# Altium project XCKU5P.PrjPCB
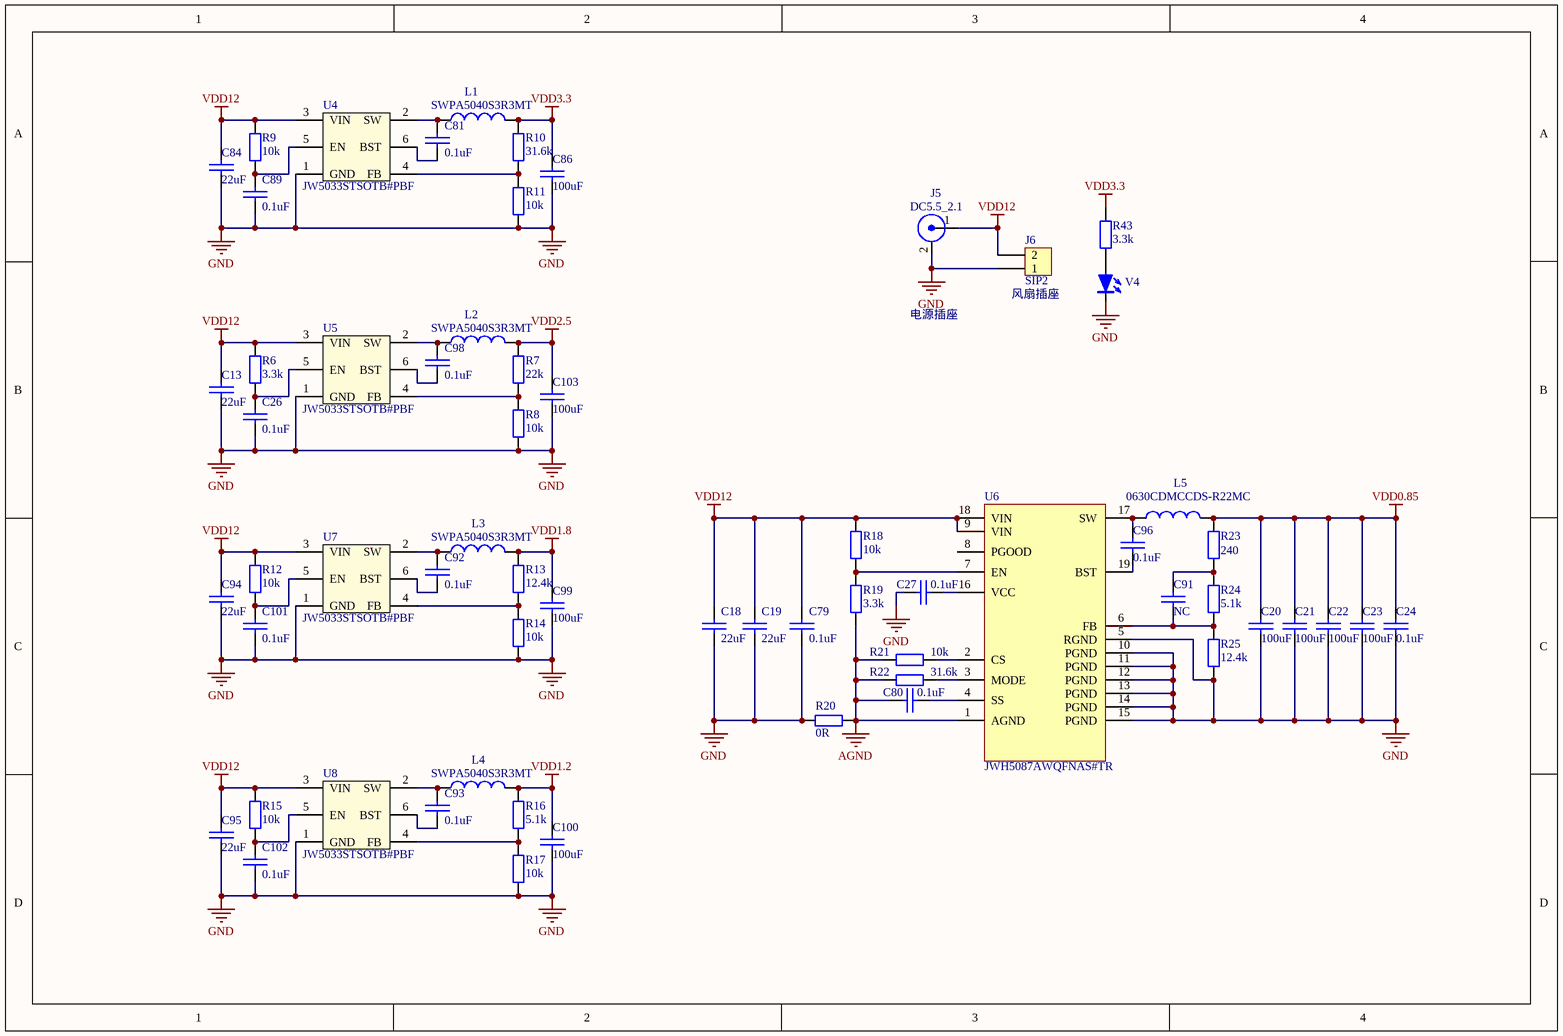
[diagram p0: POWER.SchDoc]
6 sheets, 206 parts. Net scope: global (net labels, ports and power ports of the same name join across sheets).
Board file: XCKU5P.PcbDoc
Sheets:
  POWER.SchDoc
  FPGA POWER.SchDoc
  FPGA HD BANK.SchDoc
  FPGA HP BANK.SchDoc
  FPGA SYSTERM.SchDoc
  DDR4.SchDoc

## Sheet POWER.SchDoc
size A4

### Parts
C13  22uF  [1210_C_M]
C18  22uF  [1210_C_M]
C19  22uF  [1210_C_M]
C20  100uF  [1210_C_M]
C21  100uF  [1210_C_M]
C22  100uF  [1210_C_M]
C23  100uF  [1210_C_M]
C24  0.1uF  [0402_C_M]
C26  0.1uF  [0402_C_M]
C27  0.1uF  [0402_C_M]
C79  0.1uF  [0402_C_M]
C80  0.1uF  [0402_C_M]
C81  0.1uF  [0402_C_M]
C84  22uF  [1210_C_M]
C86  100uF  [1210_C_M]
C89  0.1uF  [0402_C_M]
C91  NC  [0402_C_M]
C92  0.1uF  [0402_C_M]
C93  0.1uF  [0402_C_M]
C94  22uF  [1210_C_M]
C95  22uF  [1210_C_M]
C96  0.1uF  [0402_C_M]
C98  0.1uF  [0402_C_M]
C99  100uF  [1210_C_M]
C100  100uF  [1210_C_M]
C101  0.1uF  [0402_C_M]
C102  0.1uF  [0402_C_M]
C103  100uF  [1210_C_M]
J5  DC5.5_2.1  [DC5.5]
J6  SIP2  [2.54mm_2p]
L1  SWPA5040S3R3MT  [CD42]
L2  SWPA5040S3R3MT  [CD42]
L3  SWPA5040S3R3MT  [CD42]
L4  SWPA5040S3R3MT  [CD42]
L5  0630CDMCCDS-R22MC  [SWPA8050S]
R6  3.3k  [0402_R_M]
R7  22k  [0402_R_M]
R8  10k  [0402_R_M]
R9  10k  [0402_R_M]
R10  31.6k  [0402_R_M]
R11  10k  [0402_R_M]
R12  10k  [0402_R_M]
R13  12.4k  [0402_R_M]
R14  10k  [0402_R_M]
R15  10k  [0402_R_M]
R16  5.1k  [0402_R_M]
R17  10k  [0402_R_M]
R18  10k  [0402_R_M]
R19  3.3k  [0402_R_M]
R20  0R  [0402_R_M]
R21  10k  [0402_R_M]
R22  31.6k  [0402_R_M]
R23  240  [0402_R_M]
R24  5.1k  [0402_R_M]
R25  12.4k  [0402_R_M]
R43  3.3k  [0402_R_M]
U4  JW5033STSOTB#PBF  [SOT23-6]
U5  JW5033STSOTB#PBF  [SOT23-6]
U6  JWH5087AWQFNAS#TR
U7  JW5033STSOTB#PBF  [SOT23-6]
U8  JW5033STSOTB#PBF  [SOT23-6]
V4  LED  [0805D]  (value not drawn)

### Nets
AGND: C80.1 R19.1 R20.2 R21.2 R22.2 U6.1(AGND)
GND: C13.2 C18.1 C19.1 C20.2 C21.2 C22.2 C23.2 C24.1 C26.2 C27.2 C79.2 C84.2 C86.2 C89.2 C94.2 C95.2 C99.2 C100.2 C101.2 C102.2 C103.2 J5.2 J6.1 R8.2 R11.2 R14.2 R17.2 R20.1 R25.2 U4.1(GND) U5.1(GND) U6.5(RGND) U6.10(PGND) U6.11(PGND) U6.12(PGND) U6.13(PGND) U6.14(PGND) U6.15(PGND) U7.1(GND) U8.1(GND) V4.2
VDD0.85: C20.1 C21.1 C22.1 C23.1 C24.2 L5.2 R23.1
VDD1.2: C100.1 L4.2 R16.2
VDD1.8: C99.1 L3.2 R13.2
VDD2.5: C103.1 L2.2 R7.2
VDD3.3: C86.1 L1.2 R10.2 R43.2
VDD12: C13.1 C18.2 C19.2 C79.1 C84.1 C94.1 C95.1 J5.1 J6.2 R6.2 R9.2 R12.2 R15.2 R18.1 U4.3(VIN) U5.3(VIN) U6.9(VIN) U6.18(VIN) U7.3(VIN) U8.3(VIN)
NetC26_1: C26.1 R6.1 U5.5(EN)
NetC27_1: C27.1 U6.16(VCC)
NetC80_2: C80.2 U6.4(SS)
NetC81_1: C81.1 U4.6(BST)
NetC81_2: C81.2 L1.1 U4.2(SW)
NetC89_1: C89.1 R9.1 U4.5(EN)
NetC91_1: C91.1 R24.2 R25.1 U6.6(FB)
NetC91_2: C91.2 R23.2 R24.1
NetC92_1: C92.1 U7.6(BST)
NetC92_2: C92.2 L3.1 U7.2(SW)
NetC93_1: C93.1 U8.6(BST)
NetC93_2: C93.2 L4.1 U8.2(SW)
NetC96_1: C96.1 U6.19(BST)
NetC96_2: C96.2 L5.1 U6.17(SW)
NetC98_1: C98.1 U5.6(BST)
NetC98_2: C98.2 L2.1 U5.2(SW)
NetC101_1: C101.1 R12.1 U7.5(EN)
NetC102_1: C102.1 R15.1 U8.5(EN)
NetR7_1: R7.1 R8.1 U5.4(FB)
NetR10_1: R10.1 R11.1 U4.4(FB)
NetR13_1: R13.1 R14.1 U7.4(FB)
NetR16_1: R16.1 R17.1 U8.4(FB)
NetR18_2: R18.2 R19.2 U6.7(EN)
NetR21_1: R21.1 U6.2(CS)
NetR22_1: R22.1 U6.3(MODE)
NetR43_1: R43.1 V4.1

Not connected (* = marked no-connect by the designer): U6 8(PGOOD)

### Notes on the sheet
- (near J6) 风扇插座
- 电源插座

### Library data of the parts
C13 C18-C24 C26 C27 C79-C81 C84 C86 C89 C91-C96 C98-C103 = CAP
J5 = BNC
L1-L5 = INDUCTOR1
R6-R25 R43 = RES2
U4 U5 U7 U8 = JW5060TTSOTB#PBF
U6 = IC_JW85012
V4 = LED2

## Sheet FPGA POWER.SchDoc
size A3
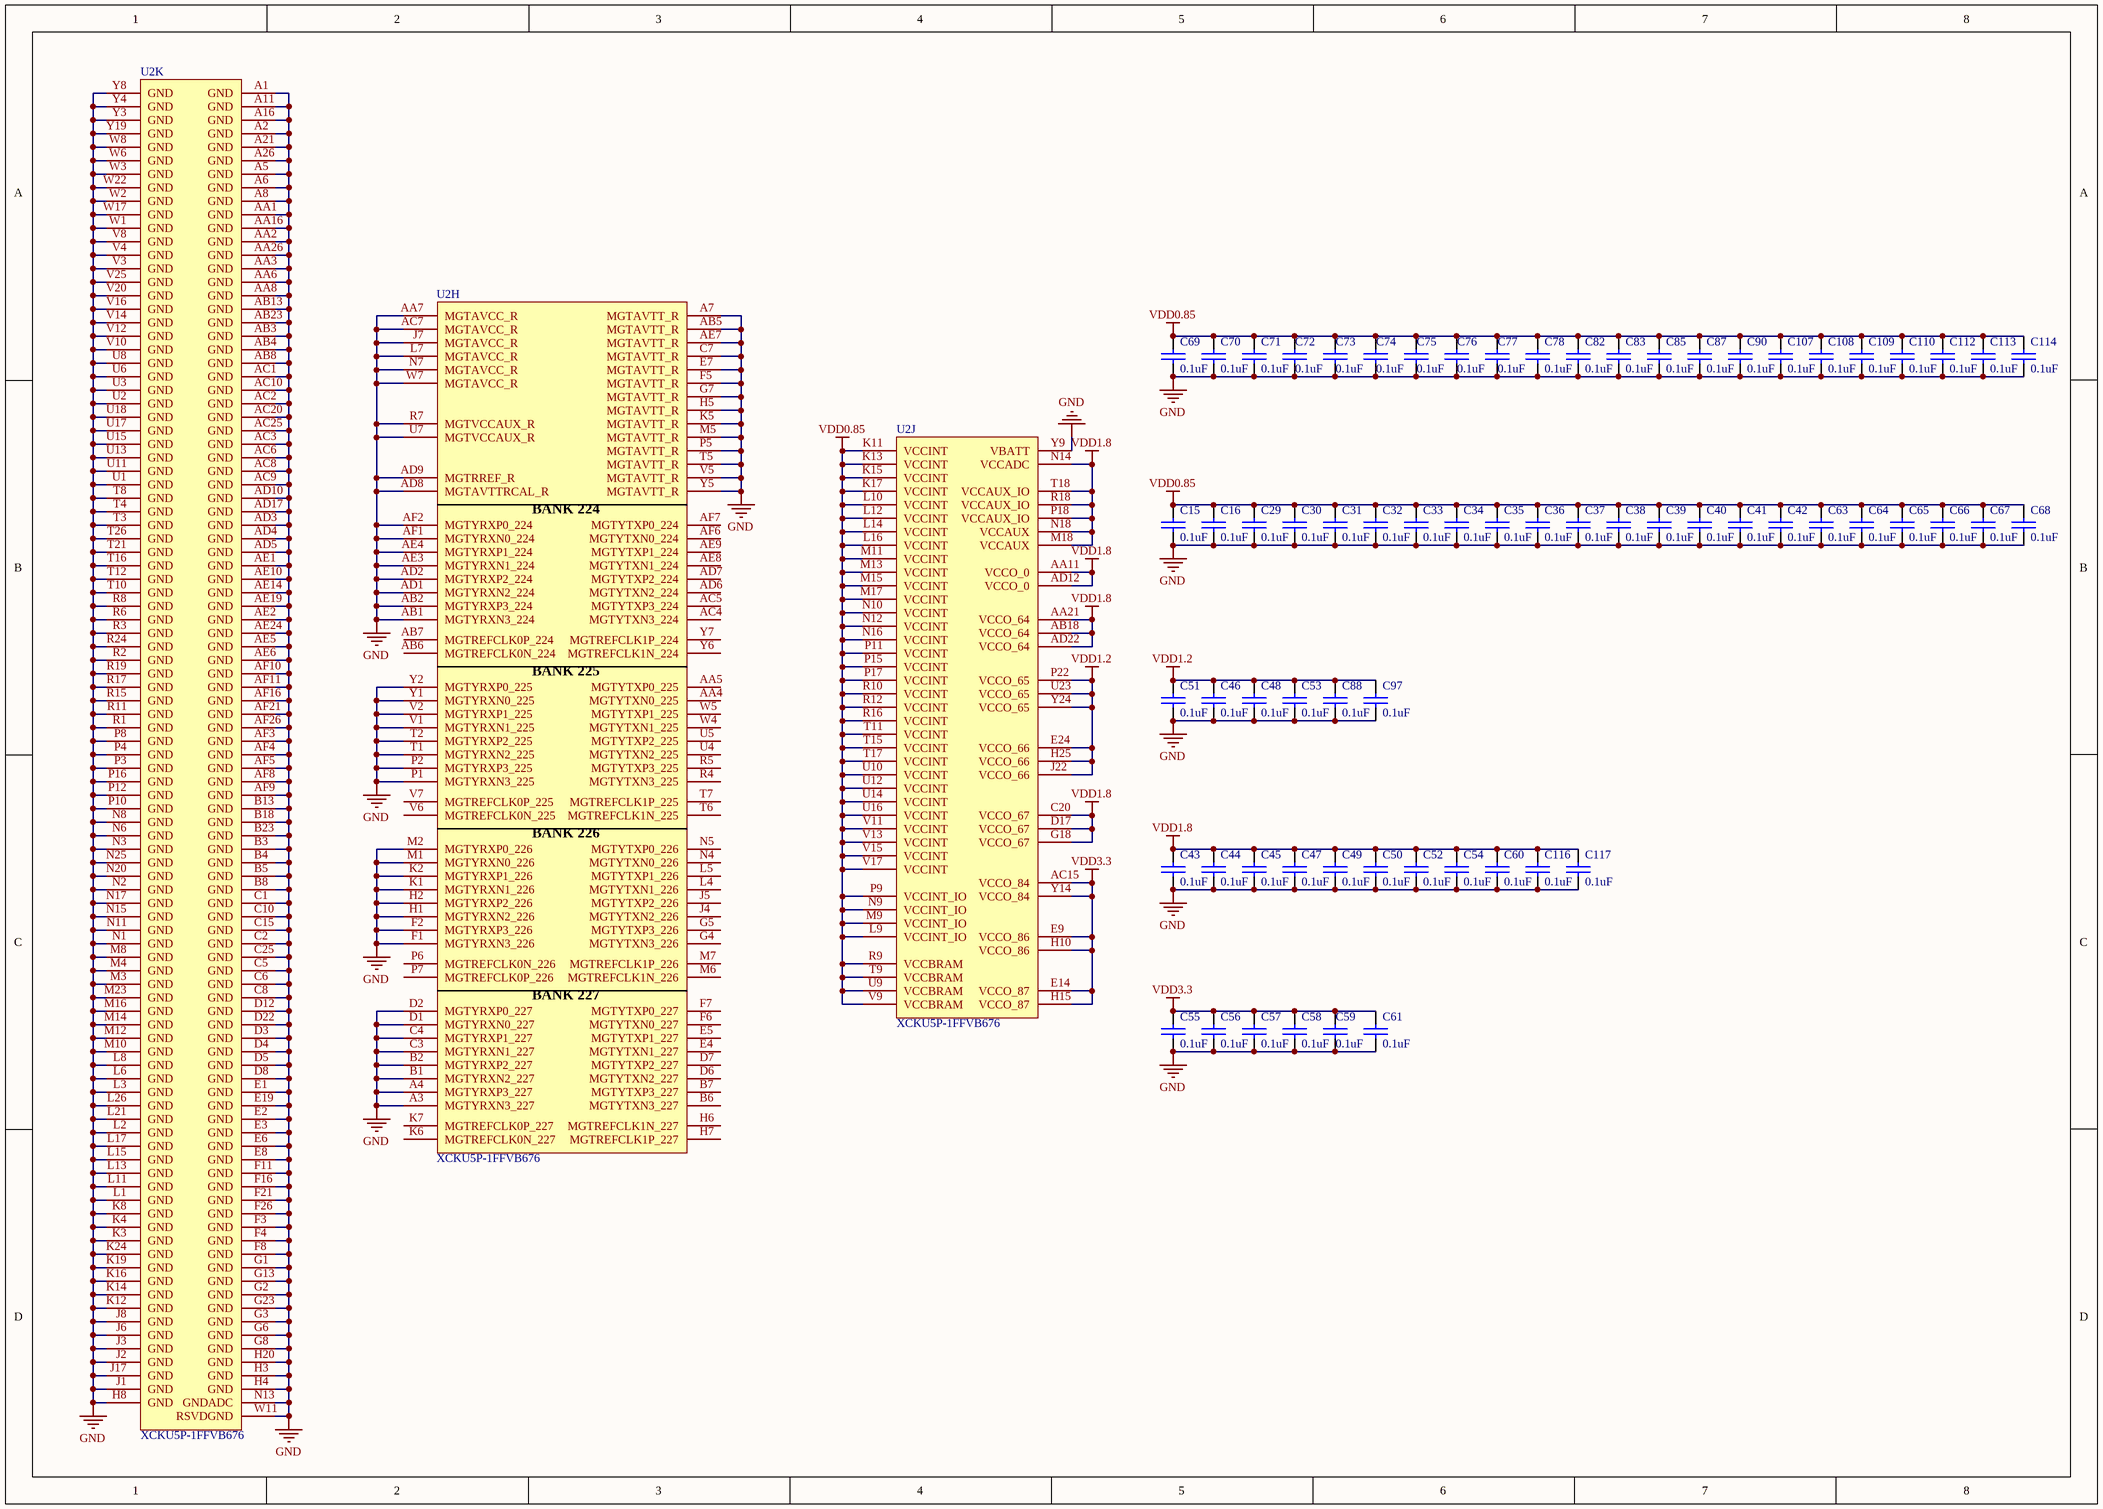
[diagram p1: FPGA POWER.SchDoc]

### Parts
C15  0.1uF  [0402_C_M]
C16  0.1uF  [0402_C_M]
C29  0.1uF  [0402_C_M]
C30  0.1uF  [0402_C_M]
C31  0.1uF  [0402_C_M]
C32  0.1uF  [0402_C_M]
C33  0.1uF  [0402_C_M]
C34  0.1uF  [0402_C_M]
C35  0.1uF  [0402_C_M]
C36  0.1uF  [0402_C_M]
C37  0.1uF  [0402_C_M]
C38  0.1uF  [0402_C_M]
C39  0.1uF  [0402_C_M]
C40  0.1uF  [0402_C_M]
C41  0.1uF  [0402_C_M]
C42  0.1uF  [0402_C_M]
C43  0.1uF  [0402_C_M]
C44  0.1uF  [0402_C_M]
C45  0.1uF  [0402_C_M]
C46  0.1uF  [0402_C_M]
C47  0.1uF  [0402_C_M]
C48  0.1uF  [0402_C_M]
C49  0.1uF  [0402_C_M]
C50  0.1uF  [0402_C_M]
C51  0.1uF  [0402_C_M]
C52  0.1uF  [0402_C_M]
C53  0.1uF  [0402_C_M]
C54  0.1uF  [0402_c_m]
C55  0.1uF  [0402_C_M]
C56  0.1uF  [0402_C_M]
C57  0.1uF  [0402_C_M]
C58  0.1uF  [0402_C_M]
C59  0.1uF  [0402_C_M]
C60  0.1uF  [0402_C_M]
C61  0.1uF  [0402_C_M]
C63  0.1uF  [0402_C_M]
C64  0.1uF  [0402_C_M]
C65  0.1uF  [0402_C_M]
C66  0.1uF  [0402_C_M]
C67  0.1uF  [0402_C_M]
C68  0.1uF  [0402_C_M]
C69  0.1uF  [0402_C_M]
C70  0.1uF  [0402_C_M]
C71  0.1uF  [0402_C_M]
C72  0.1uF  [0402_C_M]
C73  0.1uF  [0402_C_M]
C74  0.1uF  [0402_C_M]
C75  0.1uF  [0402_C_M]
C76  0.1uF  [0402_C_M]
C77  0.1uF  [0402_C_M]
C78  0.1uF  [0402_C_M]
C82  0.1uF  [0402_C_M]
C83  0.1uF  [0402_C_M]
C85  0.1uF  [0402_C_M]
C87  0.1uF  [0402_C_M]
C88  0.1uF  [0402_C_M]
C90  0.1uF  [0402_C_M]
C97  0.1uF  [0402_C_M]
C107  0.1uF  [0402_C_M]
C108  0.1uF  [0402_C_M]
C109  0.1uF  [0402_C_M]
C110  0.1uF  [0402_C_M]
C112  0.1uF  [0402_C_M]
C113  0.1uF  [0402_C_M]
C114  0.1uF  [0402_C_M]
C116  0.1uF  [0402_C_M]
C117  0.1uF  [0402_C_M]
U2  XCKU5P-1FFVB676  (parts H,J,K of 11)

### Nets
GND: C15.2 C16.2 C29.2 C30.2 C31.2 C32.2 C33.2 C34.2 C35.2 C36.2 C37.2 C38.2 C39.2 C40.2 C41.2 C42.2 C43.2 C44.2 C45.2 C46.2 C47.2 C48.2 C49.2 C50.2 C51.2 C52.2 C53.2 C54.2 C55.2 C56.2 C57.2 C58.2 C59.2 C60.2 C61.2 C63.2 C64.2 C65.2 C66.2 C67.2 C68.2 C69.2 C70.2 C71.2 C72.2 C73.2 C74.2 C75.2 C76.2 C77.2 C78.2 C82.2 C83.2 C85.2 C87.2 C88.2 C90.2 C97.2 C107.2 C108.2 C109.2 C110.2 C112.2 C113.2 C114.2 C116.2 C117.2 U2.A1(GND) U2.A2(GND) U2.A3(MGTYRXN3_227) U2.A4(MGTYRXP3_227) U2.A5(GND) U2.A6(GND) U2.A7(MGTAVTT_R) U2.A8(GND) U2.A11(GND) U2.A16(GND) U2.A21(GND) U2.A26(GND) U2.AA1(GND) U2.AA2(GND) U2.AA3(GND) U2.AA6(GND) U2.AA7(MGTAVCC_R) U2.AA8(GND) U2.AA16(GND) U2.AA26(GND) U2.AB1(MGTYRXN3_224) U2.AB2(MGTYRXP3_224) U2.AB3(GND) U2.AB4(GND) U2.AB5(MGTAVTT_R) U2.AB8(GND) U2.AB13(GND) U2.AB23(GND) U2.AC1(GND) U2.AC2(GND) U2.AC3(GND) U2.AC6(GND) U2.AC7(MGTAVCC_R) U2.AC8(GND) U2.AC9(GND) U2.AC10(GND) U2.AC20(GND) U2.AC25(GND) U2.AD1(MGTYRXN2_224) U2.AD2(MGTYRXP2_224) U2.AD3(GND) U2.AD4(GND) U2.AD5(GND) U2.AD8(MGTAVTTRCAL_R) U2.AD9(MGTRREF_R) U2.AD10(GND) U2.AD17(GND) U2.AE1(GND) U2.AE2(GND) U2.AE3(MGTYRXN1_224) U2.AE4(MGTYRXP1_224) U2.AE5(GND) U2.AE6(GND) U2.AE7(MGTAVTT_R) U2.AE10(GND) U2.AE14(GND) U2.AE19(GND) U2.AE24(GND) U2.AF1(MGTYRXN0_224) U2.AF2(MGTYRXP0_224) U2.AF3(GND) U2.AF4(GND) U2.AF5(GND) U2.AF8(GND) U2.AF9(GND) U2.AF10(GND) U2.AF11(GND) U2.AF16(GND) U2.AF21(GND) U2.AF26(GND) U2.B1(MGTYRXN2_227) U2.B2(MGTYRXP2_227) U2.B3(GND) U2.B4(GND) U2.B5(GND) U2.B8(GND) U2.B13(GND) U2.B18(GND) U2.B23(GND) U2.C1(GND) U2.C2(GND) U2.C3(MGTYRXN1_227) U2.C4(MGTYRXP1_227) U2.C5(GND) U2.C6(GND) U2.C7(MGTAVTT_R) U2.C8(GND) U2.C10(GND) U2.C15(GND) U2.C25(GND) U2.D1(MGTYRXN0_227) U2.D2(MGTYRXP0_227) U2.D3(GND) U2.D4(GND) U2.D5(GND) U2.D8(GND) U2.D12(GND) U2.D22(GND) U2.E1(GND) U2.E2(GND) U2.E3(GND) U2.E6(GND) U2.E7(MGTAVTT_R) U2.E8(GND) U2.E19(GND) U2.F1(MGTYRXN3_226) U2.F2(MGTYRXP3_226) U2.F3(GND) U2.F4(GND) U2.F5(MGTAVTT_R) U2.F8(GND) U2.F11(GND) U2.F16(GND) U2.F21(GND) U2.F26(GND) U2.G1(GND) U2.G2(GND) U2.G3(GND) U2.G6(GND) U2.G7(MGTAVTT_R) U2.G8(GND) U2.G13(GND) U2.G23(GND) U2.H1(MGTYRXN2_226) U2.H2(MGTYRXP2_226) U2.H3(GND) U2.H4(GND) U2.H5(MGTAVTT_R) U2.H8(GND) U2.H20(GND) U2.J1(GND) U2.J2(GND) U2.J3(GND) U2.J6(GND) U2.J7(MGTAVCC_R) U2.J8(GND) U2.J17(GND) U2.K1(MGTYRXN1_226) U2.K2(MGTYRXP1_226) U2.K3(GND) U2.K4(GND) U2.K5(MGTAVTT_R) U2.K8(GND) U2.K12(GND) U2.K14(GND) U2.K16(GND) U2.K19(GND) U2.K24(GND) U2.L1(GND) U2.L2(GND) U2.L3(GND) U2.L6(GND) U2.L7(MGTAVCC_R) U2.L8(GND) U2.L11(GND) U2.L13(GND) U2.L15(GND) U2.L17(GND) U2.L21(GND) U2.L26(GND) U2.M1(MGTYRXN0_226) U2.M2(MGTYRXP0_226) U2.M3(GND) U2.M4(GND) U2.M5(MGTAVTT_R) U2.M8(GND) U2.M10(GND) U2.M12(GND) U2.M14(GND) U2.M16(GND) U2.M23(GND) U2.N1(GND) U2.N2(GND) U2.N3(GND) U2.N6(GND) U2.N7(MGTAVCC_R) U2.N8(GND) U2.N11(GND) U2.N13(GNDADC) U2.N15(GND) U2.N17(GND) U2.N20(GND) U2.N25(GND) U2.P1(MGTYRXN3_225) U2.P2(MGTYRXP3_225) U2.P3(GND) U2.P4(GND) U2.P5(MGTAVTT_R) U2.P8(GND) U2.P10(GND) U2.P12(GND) U2.P16(GND) U2.R1(GND) U2.R2(GND) U2.R3(GND) U2.R6(GND) U2.R7(MGTVCCAUX_R) U2.R8(GND) U2.R11(GND) U2.R15(GND) U2.R17(GND) U2.R19(GND) U2.R24(GND) U2.T1(MGTYRXN2_225) U2.T2(MGTYRXP2_225) U2.T3(GND) U2.T4(GND) U2.T5(MGTAVTT_R) U2.T8(GND) U2.T10(GND) U2.T12(GND) U2.T16(GND) U2.T21(GND) U2.T26(GND) U2.U1(GND) U2.U2(GND) U2.U3(GND) U2.U6(GND) U2.U7(MGTVCCAUX_R) U2.U8(GND) U2.U11(GND) U2.U13(GND) U2.U15(GND) U2.U17(GND) U2.U18(GND) U2.V1(MGTYRXN1_225) U2.V2(MGTYRXP1_225) U2.V3(GND) U2.V4(GND) U2.V5(MGTAVTT_R) U2.V8(GND) U2.V10(GND) U2.V12(GND) U2.V14(GND) U2.V16(GND) U2.V20(GND) U2.V25(GND) U2.W1(GND) U2.W2(GND) U2.W3(GND) U2.W6(GND) U2.W7(MGTAVCC_R) U2.W8(GND) U2.W11(RSVDGND) U2.W17(GND) U2.W22(GND) U2.Y1(MGTYRXN0_225) U2.Y2(MGTYRXP0_225) U2.Y3(GND) U2.Y4(GND) U2.Y5(MGTAVTT_R) U2.Y8(GND) U2.Y9(VBATT) U2.Y19(GND)
VDD0.85: C15.1 C16.1 C29.1 C30.1 C31.1 C32.1 C33.1 C34.1 C35.1 C36.1 C37.1 C38.1 C39.1 C40.1 C41.1 C42.1 C63.1 C64.1 C65.1 C66.1 C67.1 C68.1 C69.1 C70.1 C71.1 C72.1 C73.1 C74.1 C75.1 C76.1 C77.1 C78.1 C82.1 C83.1 C85.1 C87.1 C90.1 C107.1 C108.1 C109.1 C110.1 C112.1 C113.1 C114.1 U2.K11(VCCINT) U2.K13(VCCINT) U2.K15(VCCINT) U2.K17(VCCINT) U2.L9(VCCINT_IO) U2.L10(VCCINT) U2.L12(VCCINT) U2.L14(VCCINT) U2.L16(VCCINT) U2.M9(VCCINT_IO) U2.M11(VCCINT) U2.M13(VCCINT) U2.M15(VCCINT) U2.M17(VCCINT) U2.N9(VCCINT_IO) U2.N10(VCCINT) U2.N12(VCCINT) U2.N16(VCCINT) U2.P9(VCCINT_IO) U2.P11(VCCINT) U2.P15(VCCINT) U2.P17(VCCINT) U2.R9(VCCBRAM) U2.R10(VCCINT) U2.R12(VCCINT) U2.R16(VCCINT) U2.T9(VCCBRAM) U2.T11(VCCINT) U2.T15(VCCINT) U2.T17(VCCINT) U2.U9(VCCBRAM) U2.U10(VCCINT) U2.U12(VCCINT) U2.U14(VCCINT) U2.U16(VCCINT) U2.V9(VCCBRAM) U2.V11(VCCINT) U2.V13(VCCINT) U2.V15(VCCINT) U2.V17(VCCINT)
VDD1.2: C46.1 C48.1 C51.1 C53.1 C88.1 C97.1 U2.E24(VCCO_66) U2.H25(VCCO_66) U2.J22(VCCO_66) U2.P22(VCCO_65) U2.U23(VCCO_65) U2.Y24(VCCO_65)
VDD1.8: C43.1 C44.1 C45.1 C47.1 C49.1 C50.1 C52.1 C54.1 C60.1 C116.1 C117.1 U2.AA11(VCCO_0) U2.AA21(VCCO_64) U2.AB18(VCCO_64) U2.AD12(VCCO_0) U2.AD22(VCCO_64) U2.C20(VCCO_67) U2.D17(VCCO_67) U2.G18(VCCO_67) U2.M18(VCCAUX) U2.N14(VCCADC) U2.N18(VCCAUX) U2.P18(VCCAUX_IO) U2.R18(VCCAUX_IO) U2.T18(VCCAUX_IO)
VDD3.3: C55.1 C56.1 C57.1 C58.1 C59.1 C61.1 U2.AC15(VCCO_84) U2.E9(VCCO_86) U2.E14(VCCO_87) U2.H10(VCCO_86) U2.H15(VCCO_87) U2.Y14(VCCO_84)

Not connected (* = marked no-connect by the designer): U2 AA4(MGTYTXN0_225) AA5(MGTYTXP0_225) AB6(MGTREFCLK0N_224) AB7(MGTREFCLK0P_224) AC4(MGTYTXN3_224) AC5(MGTYTXP3_224) AD6(MGTYTXN2_224) AD7(MGTYTXP2_224) AE8(MGTYTXN1_224) AE9(MGTYTXP1_224) AF6(MGTYTXN0_224) AF7(MGTYTXP0_224) B6(MGTYTXN3_227) B7(MGTYTXP3_227) D6(MGTYTXN2_227) D7(MGTYTXP2_227) E4(MGTYTXN1_227) E5(MGTYTXP1_227) F6(MGTYTXN0_227) F7(MGTYTXP0_227) G4(MGTYTXN3_226) G5(MGTYTXP3_226) H6(MGTREFCLK1N_227) H7(MGTREFCLK1P_227) J4(MGTYTXN2_226) J5(MGTYTXP2_226) K6(MGTREFCLK0N_227) K7(MGTREFCLK0P_227) L4(MGTYTXN1_226) L5(MGTYTXP1_226) M6(MGTREFCLK1N_226) M7(MGTREFCLK1P_226) N4(MGTYTXN0_226) N5(MGTYTXP0_226) P6(MGTREFCLK0N_226) P7(MGTREFCLK0P_226) R4(MGTYTXN3_225) R5(MGTYTXP3_225) T6(MGTREFCLK1N_225) T7(MGTREFCLK1P_225) U4(MGTYTXN2_225) U5(MGTYTXP2_225) V6(MGTREFCLK0N_225) V7(MGTREFCLK0P_225) W4(MGTYTXN1_225) W5(MGTYTXP1_225) Y6(MGTREFCLK1N_224) Y7(MGTREFCLK1P_224)

### Notes on the sheet
- (in symbol XCKU5P-FFVB676, part H) BANK 224; BANK 225; BANK 226; BANK 227

### Library data of the parts
C15 C16 C29-C61 C63-C78 C82 C83 C85 C87 C88 C90 C97 C107-C110 C112-C114 C116 C117 = CAP
U2 = XCKU5P-FFVB676

## Sheet FPGA HD BANK.SchDoc
size A3
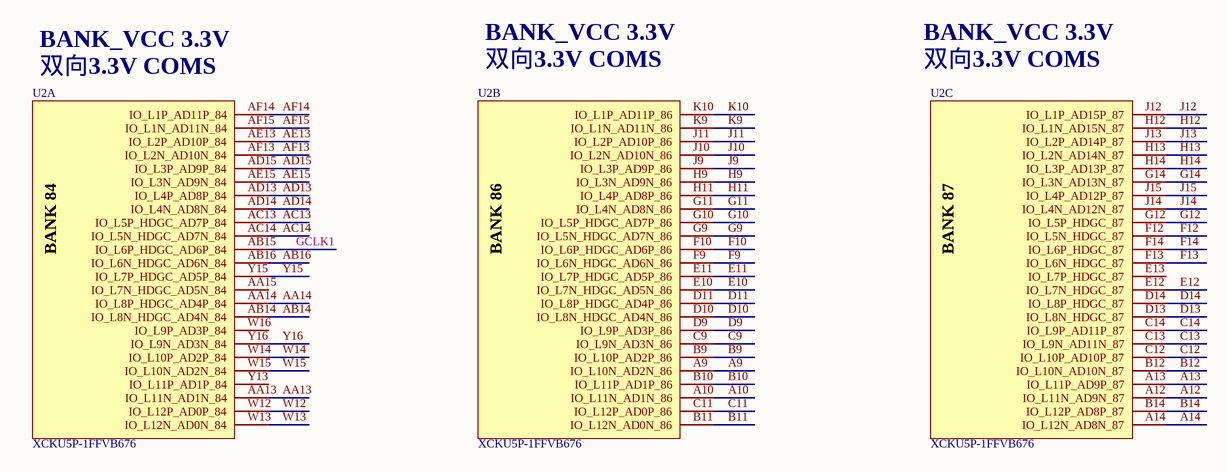
[diagram p2: FPGA HD BANK.SchDoc]

### Parts
U2  XCKU5P-1FFVB676  (parts A,B,C of 11)

### Nets
A9: U2.A9(IO_L10N_AD2N_86)
A10: U2.A10(IO_L11N_AD1N_86)
A12: U2.A12(IO_L11N_AD9N_87)
A13: U2.A13(IO_L11P_AD9P_87)
A14: U2.A14(IO_L12N_AD8N_87)
AA13: U2.AA13(IO_L11N_AD1N_84)
AA14: U2.AA14(IO_L8P_HDGC_AD4P_84)
AB14: U2.AB14(IO_L8N_HDGC_AD4N_84)
AB16: U2.AB16(IO_L6N_HDGC_AD6N_84)
AC13: U2.AC13(IO_L5P_HDGC_AD7P_84)
AC14: U2.AC14(IO_L5N_HDGC_AD7N_84)
AD13: U2.AD13(IO_L4P_AD8P_84)
AD14: U2.AD14(IO_L4N_AD8N_84)
AD15: U2.AD15(IO_L3P_AD9P_84)
AE13: U2.AE13(IO_L2P_AD10P_84)
AE15: U2.AE15(IO_L3N_AD9N_84)
AF13: U2.AF13(IO_L2N_AD10N_84)
AF14: U2.AF14(IO_L1P_AD11P_84)
AF15: U2.AF15(IO_L1N_AD11N_84)
B9: U2.B9(IO_L10P_AD2P_86)
B10: U2.B10(IO_L11P_AD1P_86)
B11: U2.B11(IO_L12N_AD0N_86)
B12: U2.B12(IO_L10N_AD10N_87)
B14: U2.B14(IO_L12P_AD8P_87)
C9: U2.C9(IO_L9N_AD3N_86)
C11: U2.C11(IO_L12P_AD0P_86)
C12: U2.C12(IO_L10P_AD10P_87)
C13: U2.C13(IO_L9N_AD11N_87)
C14: U2.C14(IO_L9P_AD11P_87)
D9: U2.D9(IO_L9P_AD3P_86)
D10: U2.D10(IO_L8N_HDGC_AD4N_86)
D11: U2.D11(IO_L8P_HDGC_AD4P_86)
D13: U2.D13(IO_L8N_HDGC_87)
D14: U2.D14(IO_L8P_HDGC_87)
E10: U2.E10(IO_L7N_HDGC_AD5N_86)
E11: U2.E11(IO_L7P_HDGC_AD5P_86)
E12: U2.E12(IO_L7N_HDGC_87)
F9: U2.F9(IO_L6N_HDGC_AD6N_86)
F10: U2.F10(IO_L6P_HDGC_AD6P_86)
F12: U2.F12(IO_L5N_HDGC_87)
F13: U2.F13(IO_L6N_HDGC_87)
F14: U2.F14(IO_L6P_HDGC_87)
G9: U2.G9(IO_L5N_HDGC_AD7N_86)
G10: U2.G10(IO_L5P_HDGC_AD7P_86)
G11: U2.G11(IO_L4N_AD8N_86)
G12: U2.G12(IO_L5P_HDGC_87)
G14: U2.G14(IO_L3N_AD13N_87)
GCLK1: U2.AB15(IO_L6P_HDGC_AD6P_84)
H9: U2.H9(IO_L3N_AD9N_86)
H11: U2.H11(IO_L4P_AD8P_86)
H12: U2.H12(IO_L1N_AD15N_87)
H13: U2.H13(IO_L2N_AD14N_87)
H14: U2.H14(IO_L3P_AD13P_87)
J9: U2.J9(IO_L3P_AD9P_86)
J10: U2.J10(IO_L2N_AD10N_86)
J11: U2.J11(IO_L2P_AD10P_86)
J12: U2.J12(IO_L1P_AD15P_87)
J13: U2.J13(IO_L2P_AD14P_87)
J14: U2.J14(IO_L4N_AD12N_87)
J15: U2.J15(IO_L4P_AD12P_87)
K9: U2.K9(IO_L1N_AD11N_86)
K10: U2.K10(IO_L1P_AD11P_86)
W12: U2.W12(IO_L12P_AD0P_84)
W13: U2.W13(IO_L12N_AD0N_84)
W14: U2.W14(IO_L10P_AD2P_84)
W15: U2.W15(IO_L10N_AD2N_84)
Y15: U2.Y15(IO_L7P_HDGC_AD5P_84)
Y16: U2.Y16(IO_L9N_AD3N_84)

Not connected (* = marked no-connect by the designer): U2 AA15(IO_L7N_HDGC_AD5N_84) E13(IO_L7P_HDGC_87) W16(IO_L9P_AD3P_84) Y13(IO_L11P_AD1P_84)

### Notes on the sheet
- BANK_VCC 3.3V
- 双向3.3V COMS
- (in symbol XCKU5P-FFVB676, part A) BANK 84
- (in symbol XCKU5P-FFVB676, part B) BANK 86
- (in symbol XCKU5P-FFVB676, part C) BANK 87

### Library data of the parts
U2 = XCKU5P-FFVB676

## Sheet FPGA HP BANK.SchDoc
size A3
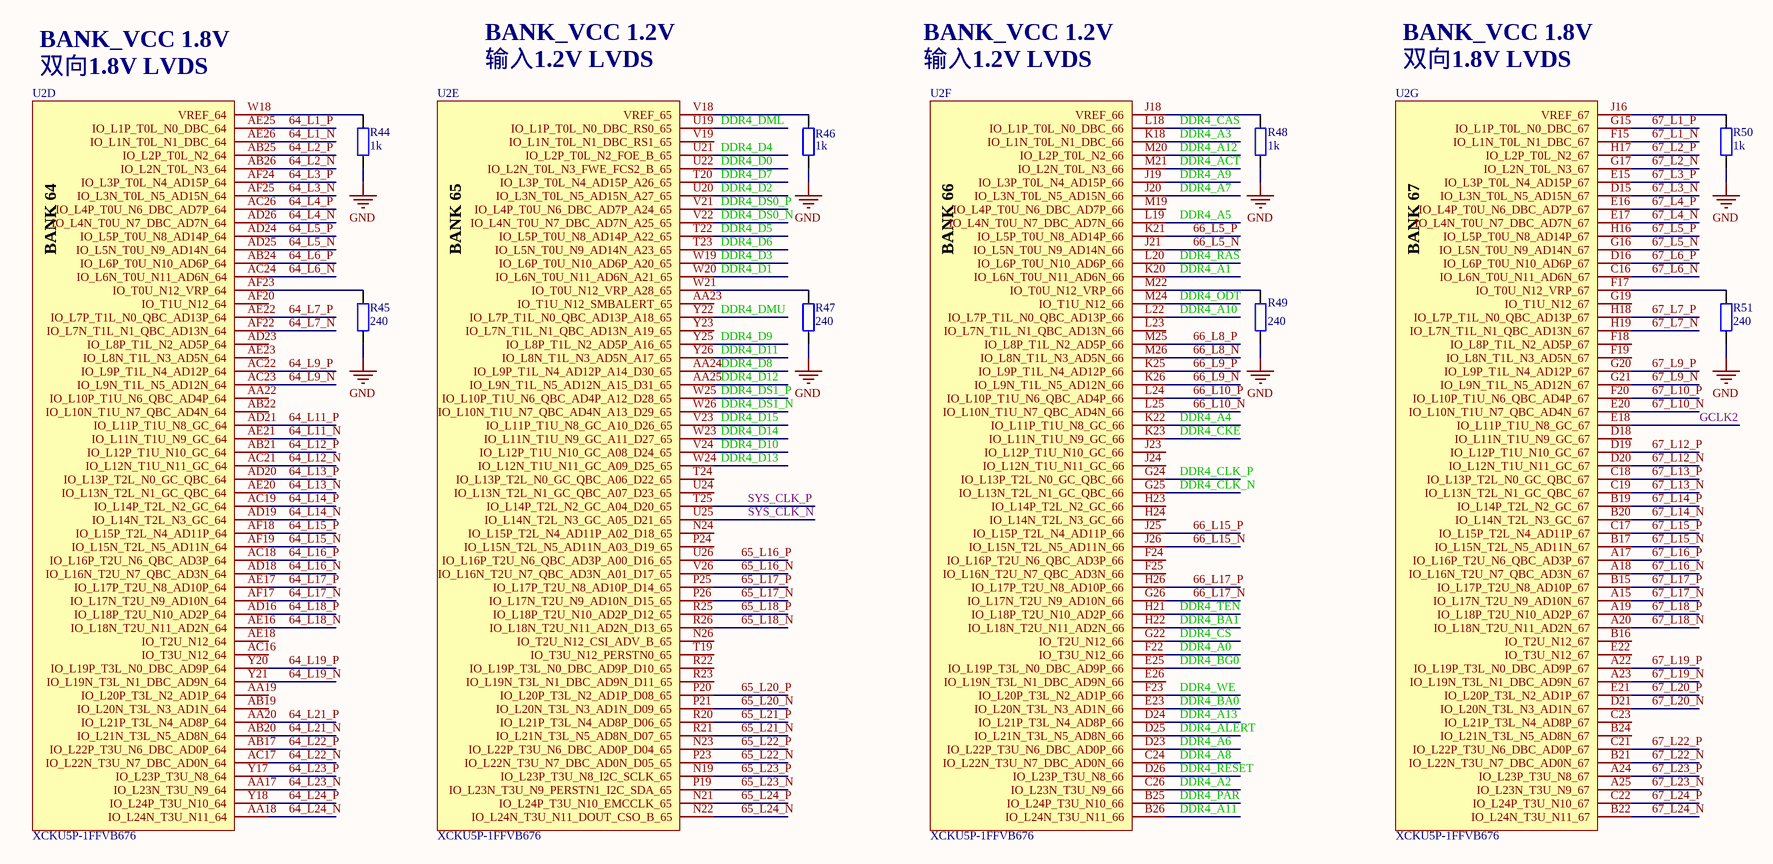
[diagram p3: FPGA HP BANK.SchDoc]

### Parts
R44  1k  [0402_R_M]
R45  240  [0402_R_M]
R46  1k  [0402_R_M]
R47  240  [0402_R_M]
R48  1k  [0402_R_M]
R49  240  [0402_R_M]
R50  1k  [0402_R_M]
R51  240  [0402_R_M]
U2  XCKU5P-1FFVB676  (parts D,E,F,G of 11)

### Nets
GND: R44.2 R45.2 R46.2 R47.2 R48.2 R49.2 R50.2 R51.2
64_L1_N: U2.AE26(IO_L1N_T0L_N1_DBC_64)
64_L1_P: U2.AE25(IO_L1P_T0L_N0_DBC_64)
64_L2_N: U2.AB26(IO_L2N_T0L_N3_64)
64_L2_P: U2.AB25(IO_L2P_T0L_N2_64)
64_L3_N: U2.AF25(IO_L3N_T0L_N5_AD15N_64)
64_L3_P: U2.AF24(IO_L3P_T0L_N4_AD15P_64)
64_L4_N: U2.AD26(IO_L4N_T0U_N7_DBC_AD7N_64)
64_L4_P: U2.AC26(IO_L4P_T0U_N6_DBC_AD7P_64)
64_L5_N: U2.AD25(IO_L5N_T0U_N9_AD14N_64)
64_L5_P: U2.AD24(IO_L5P_T0U_N8_AD14P_64)
64_L6_N: U2.AC24(IO_L6N_T0U_N11_AD6N_64)
64_L6_P: U2.AB24(IO_L6P_T0U_N10_AD6P_64)
64_L7_N: U2.AF22(IO_L7N_T1L_N1_QBC_AD13N_64)
64_L7_P: U2.AE22(IO_L7P_T1L_N0_QBC_AD13P_64)
64_L9_N: U2.AC23(IO_L9N_T1L_N5_AD12N_64)
64_L9_P: U2.AC22(IO_L9P_T1L_N4_AD12P_64)
64_L11_N: U2.AE21(IO_L11N_T1U_N9_GC_64)
64_L11_P: U2.AD21(IO_L11P_T1U_N8_GC_64)
64_L12_N: U2.AC21(IO_L12N_T1U_N11_GC_64)
64_L12_P: U2.AB21(IO_L12P_T1U_N10_GC_64)
64_L13_N: U2.AE20(IO_L13N_T2L_N1_GC_QBC_64)
64_L13_P: U2.AD20(IO_L13P_T2L_N0_GC_QBC_64)
64_L14_N: U2.AD19(IO_L14N_T2L_N3_GC_64)
64_L14_P: U2.AC19(IO_L14P_T2L_N2_GC_64)
64_L15_N: U2.AF19(IO_L15N_T2L_N5_AD11N_64)
64_L15_P: U2.AF18(IO_L15P_T2L_N4_AD11P_64)
64_L16_N: U2.AD18(IO_L16N_T2U_N7_QBC_AD3N_64)
64_L16_P: U2.AC18(IO_L16P_T2U_N6_QBC_AD3P_64)
64_L17_N: U2.AF17(IO_L17N_T2U_N9_AD10N_64)
64_L17_P: U2.AE17(IO_L17P_T2U_N8_AD10P_64)
64_L18_N: U2.AE16(IO_L18N_T2U_N11_AD2N_64)
64_L18_P: U2.AD16(IO_L18P_T2U_N10_AD2P_64)
64_L19_N: U2.Y21(IO_L19N_T3L_N1_DBC_AD9N_64)
64_L19_P: U2.Y20(IO_L19P_T3L_N0_DBC_AD9P_64)
64_L21_N: U2.AB20(IO_L21N_T3L_N5_AD8N_64)
64_L21_P: U2.AA20(IO_L21P_T3L_N4_AD8P_64)
64_L22_N: U2.AC17(IO_L22N_T3U_N7_DBC_AD0N_64)
64_L22_P: U2.AB17(IO_L22P_T3U_N6_DBC_AD0P_64)
64_L23_N: U2.AA17(IO_L23N_T3U_N9_64)
64_L23_P: U2.Y17(IO_L23P_T3U_N8_64)
64_L24_N: U2.AA18(IO_L24N_T3U_N11_64)
64_L24_P: U2.Y18(IO_L24P_T3U_N10_64)
65_L16_N: U2.V26(IO_L16N_T2U_N7_QBC_AD3N_A01_D17_65)
65_L16_P: U2.U26(IO_L16P_T2U_N6_QBC_AD3P_A00_D16_65)
65_L17_N: U2.P26(IO_L17N_T2U_N9_AD10N_D15_65)
65_L17_P: U2.P25(IO_L17P_T2U_N8_AD10P_D14_65)
65_L18_N: U2.R26(IO_L18N_T2U_N11_AD2N_D13_65)
65_L18_P: U2.R25(IO_L18P_T2U_N10_AD2P_D12_65)
65_L20_N: U2.P21(IO_L20N_T3L_N3_AD1N_D09_65)
65_L20_P: U2.P20(IO_L20P_T3L_N2_AD1P_D08_65)
65_L21_N: U2.R21(IO_L21N_T3L_N5_AD8N_D07_65)
65_L21_P: U2.R20(IO_L21P_T3L_N4_AD8P_D06_65)
65_L22_N: U2.P23(IO_L22N_T3U_N7_DBC_AD0N_D05_65)
65_L22_P: U2.N23(IO_L22P_T3U_N6_DBC_AD0P_D04_65)
65_L23_N: U2.P19(IO_L23N_T3U_N9_PERSTN1_I2C_SDA_65)
65_L23_P: U2.N19(IO_L23P_T3U_N8_I2C_SCLK_65)
65_L24_N: U2.N22(IO_L24N_T3U_N11_DOUT_CSO_B_65)
65_L24_P: U2.N21(IO_L24P_T3U_N10_EMCCLK_65)
66_L5_N: U2.J21(IO_L5N_T0U_N9_AD14N_66)
66_L5_P: U2.K21(IO_L5P_T0U_N8_AD14P_66)
66_L8_N: U2.M26(IO_L8N_T1L_N3_AD5N_66)
66_L8_P: U2.M25(IO_L8P_T1L_N2_AD5P_66)
66_L9_N: U2.K26(IO_L9N_T1L_N5_AD12N_66)
66_L9_P: U2.K25(IO_L9P_T1L_N4_AD12P_66)
66_L10_N: U2.L25(IO_L10N_T1U_N7_QBC_AD4N_66)
66_L10_P: U2.L24(IO_L10P_T1U_N6_QBC_AD4P_66)
66_L15_N: U2.J26(IO_L15N_T2L_N5_AD11N_66)
66_L15_P: U2.J25(IO_L15P_T2L_N4_AD11P_66)
66_L17_N: U2.G26(IO_L17N_T2U_N9_AD10N_66)
66_L17_P: U2.H26(IO_L17P_T2U_N8_AD10P_66)
67_L1_N: U2.F15(IO_L1N_T0L_N1_DBC_67)
67_L1_P: U2.G15(IO_L1P_T0L_N0_DBC_67)
67_L2_N: U2.G17(IO_L2N_T0L_N3_67)
67_L2_P: U2.H17(IO_L2P_T0L_N2_67)
67_L3_N: U2.D15(IO_L3N_T0L_N5_AD15N_67)
67_L3_P: U2.E15(IO_L3P_T0L_N4_AD15P_67)
67_L4_N: U2.E17(IO_L4N_T0U_N7_DBC_AD7N_67)
67_L4_P: U2.E16(IO_L4P_T0U_N6_DBC_AD7P_67)
67_L5_N: U2.G16(IO_L5N_T0U_N9_AD14N_67)
67_L5_P: U2.H16(IO_L5P_T0U_N8_AD14P_67)
67_L6_N: U2.C16(IO_L6N_T0U_N11_AD6N_67)
67_L6_P: U2.D16(IO_L6P_T0U_N10_AD6P_67)
67_L7_N: U2.H19(IO_L7N_T1L_N1_QBC_AD13N_67)
67_L7_P: U2.H18(IO_L7P_T1L_N0_QBC_AD13P_67)
67_L9_N: U2.G21(IO_L9N_T1L_N5_AD12N_67)
67_L9_P: U2.G20(IO_L9P_T1L_N4_AD12P_67)
67_L10_N: U2.E20(IO_L10N_T1U_N7_QBC_AD4N_67)
67_L10_P: U2.F20(IO_L10P_T1U_N6_QBC_AD4P_67)
67_L12_N: U2.D20(IO_L12N_T1U_N11_GC_67)
67_L12_P: U2.D19(IO_L12P_T1U_N10_GC_67)
67_L13_N: U2.C19(IO_L13N_T2L_N1_GC_QBC_67)
67_L13_P: U2.C18(IO_L13P_T2L_N0_GC_QBC_67)
67_L14_N: U2.B20(IO_L14N_T2L_N3_GC_67)
67_L14_P: U2.B19(IO_L14P_T2L_N2_GC_67)
67_L15_N: U2.B17(IO_L15N_T2L_N5_AD11N_67)
67_L15_P: U2.C17(IO_L15P_T2L_N4_AD11P_67)
67_L16_N: U2.A18(IO_L16N_T2U_N7_QBC_AD3N_67)
67_L16_P: U2.A17(IO_L16P_T2U_N6_QBC_AD3P_67)
67_L17_N: U2.A15(IO_L17N_T2U_N9_AD10N_67)
67_L17_P: U2.B15(IO_L17P_T2U_N8_AD10P_67)
67_L18_N: U2.A20(IO_L18N_T2U_N11_AD2N_67)
67_L18_P: U2.A19(IO_L18P_T2U_N10_AD2P_67)
67_L19_N: U2.A23(IO_L19N_T3L_N1_DBC_AD9N_67)
67_L19_P: U2.A22(IO_L19P_T3L_N0_DBC_AD9P_67)
67_L20_N: U2.D21(IO_L20N_T3L_N3_AD1N_67)
67_L20_P: U2.E21(IO_L20P_T3L_N2_AD1P_67)
67_L22_N: U2.B21(IO_L22N_T3U_N7_DBC_AD0N_67)
67_L22_P: U2.C21(IO_L22P_T3U_N6_DBC_AD0P_67)
67_L23_N: U2.A25(IO_L23N_T3U_N9_67)
67_L23_P: U2.A24(IO_L23P_T3U_N8_67)
67_L24_N: U2.B22(IO_L24N_T3U_N11_67)
67_L24_P: U2.C22(IO_L24P_T3U_N10_67)
DDR4_A0: U2.F22(IO_T3U_N12_66)
DDR4_A1: U2.K20(IO_L6N_T0U_N11_AD6N_66)
DDR4_A2: U2.C26(IO_L23N_T3U_N9_66)
DDR4_A3: U2.K18(IO_L1N_T0L_N1_DBC_66)
DDR4_A4: U2.K22(IO_L11P_T1U_N8_GC_66)
DDR4_A5: U2.L19(IO_L4N_T0U_N7_DBC_AD7N_66)
DDR4_A6: U2.D23(IO_L22P_T3U_N6_DBC_AD0P_66)
DDR4_A7: U2.J20(IO_L3N_T0L_N5_AD15N_66)
DDR4_A8: U2.C24(IO_L22N_T3U_N7_DBC_AD0N_66)
DDR4_A9: U2.J19(IO_L3P_T0L_N4_AD15P_66)
DDR4_A10: U2.L22(IO_L7P_T1L_N0_QBC_AD13P_66)
DDR4_A11: U2.B26(IO_L24N_T3U_N11_66)
DDR4_A12: U2.M20(IO_L2P_T0L_N2_66)
DDR4_A13: U2.D24(IO_L21P_T3L_N4_AD8P_66)
DDR4_ACT: U2.M21(IO_L2N_T0L_N3_66)
DDR4_ALERT: U2.D25(IO_L21N_T3L_N5_AD8N_66)
DDR4_BA0: U2.E23(IO_L20N_T3L_N3_AD1N_66)
DDR4_BA1: U2.H22(IO_L18N_T2U_N11_AD2N_66)
DDR4_BG0: U2.E25(IO_L19P_T3L_N0_DBC_AD9P_66)
DDR4_CAS: U2.L18(IO_L1P_T0L_N0_DBC_66)
DDR4_CKE: U2.K23(IO_L11N_T1U_N9_GC_66)
DDR4_CLK_N: U2.G25(IO_L13N_T2L_N1_GC_QBC_66)
DDR4_CLK_P: U2.G24(IO_L13P_T2L_N0_GC_QBC_66)
DDR4_CS: U2.G22(IO_T2U_N12_66)
DDR4_D0: U2.U22(IO_L2N_T0L_N3_FWE_FCS2_B_65)
DDR4_D1: U2.W20(IO_L6N_T0U_N11_AD6N_A21_65)
DDR4_D2: U2.U20(IO_L3N_T0L_N5_AD15N_A27_65)
DDR4_D3: U2.W19(IO_L6P_T0U_N10_AD6P_A20_65)
DDR4_D4: U2.U21(IO_L2P_T0L_N2_FOE_B_65)
DDR4_D5: U2.T22(IO_L5P_T0U_N8_AD14P_A22_65)
DDR4_D6: U2.T23(IO_L5N_T0U_N9_AD14N_A23_65)
DDR4_D7: U2.T20(IO_L3P_T0L_N4_AD15P_A26_65)
DDR4_D8: U2.AA24(IO_L9P_T1L_N4_AD12P_A14_D30_65)
DDR4_D9: U2.Y25(IO_L8P_T1L_N2_AD5P_A16_65)
DDR4_D10: U2.V24(IO_L12P_T1U_N10_GC_A08_D24_65)
DDR4_D11: U2.Y26(IO_L8N_T1L_N3_AD5N_A17_65)
DDR4_D12: U2.AA25(IO_L9N_T1L_N5_AD12N_A15_D31_65)
DDR4_D13: U2.W24(IO_L12N_T1U_N11_GC_A09_D25_65)
DDR4_D14: U2.W23(IO_L11N_T1U_N9_GC_A11_D27_65)
DDR4_D15: U2.V23(IO_L11P_T1U_N8_GC_A10_D26_65)
DDR4_DML: U2.U19(IO_L1P_T0L_N0_DBC_RS0_65)
DDR4_DMU: U2.Y22(IO_L7P_T1L_N0_QBC_AD13P_A18_65)
DDR4_DS0_N: U2.V22(IO_L4N_T0U_N7_DBC_AD7N_A25_65)
DDR4_DS0_P: U2.V21(IO_L4P_T0U_N6_DBC_AD7P_A24_65)
DDR4_DS1_N: U2.W26(IO_L10N_T1U_N7_QBC_AD4N_A13_D29_65)
DDR4_DS1_P: U2.W25(IO_L10P_T1U_N6_QBC_AD4P_A12_D28_65)
DDR4_ODT: U2.M24(IO_T1U_N12_66)
DDR4_PAR: U2.B25(IO_L24P_T3U_N10_66)
DDR4_RAS: U2.L20(IO_L6P_T0U_N10_AD6P_66)
DDR4_RESET: U2.D26(IO_L23P_T3U_N8_66)
DDR4_TEN: U2.H21(IO_L18P_T2U_N10_AD2P_66)
DDR4_WE: U2.F23(IO_L20P_T3L_N2_AD1P_66)
GCLK2: U2.E18(IO_L11P_T1U_N8_GC_67)
SYS_CLK_N: U2.U25(IO_L14N_T2L_N3_GC_A05_D21_65)
SYS_CLK_P: U2.T25(IO_L14P_T2L_N2_GC_A04_D20_65)
NetR44_1: R44.1 U2.W18(VREF_64)
NetR45_1: R45.1 U2.AF23(IO_T0U_N12_VRP_64)
NetR46_1: R46.1 U2.V18(VREF_65)
NetR47_1: R47.1 U2.W21(IO_T0U_N12_VRP_A28_65)
NetR48_1: R48.1 U2.J18(VREF_66)
NetR49_1: R49.1 U2.M22(IO_T0U_N12_VRP_66)
NetR50_1: R50.1 U2.J16(VREF_67)
NetR51_1: R51.1 U2.F17(IO_T0U_N12_VRP_67)

Not connected (* = marked no-connect by the designer): U2 AA19(IO_L20P_T3L_N2_AD1P_64) AA22(IO_L10P_T1U_N6_QBC_AD4P_64) AA23(IO_T1U_N12_SMBALERT_65) AB19(IO_L20N_T3L_N3_AD1N_64) AB22(IO_L10N_T1U_N7_QBC_AD4N_64) AC16(IO_T3U_N12_64) AD23(IO_L8P_T1L_N2_AD5P_64) AE18(IO_T2U_N12_64) AE23(IO_L8N_T1L_N3_AD5N_64) AF20(IO_T1U_N12_64) B16(IO_T2U_N12_67) B24(IO_L21N_T3L_N5_AD8N_67) C23(IO_L21P_T3L_N4_AD8P_67) D18(IO_L11N_T1U_N9_GC_67) E22(IO_T3U_N12_67) E26(IO_L19N_T3L_N1_DBC_AD9N_66) F18(IO_L8P_T1L_N2_AD5P_67) F19(IO_L8N_T1L_N3_AD5N_67) F24(IO_L16P_T2U_N6_QBC_AD3P_66) F25(IO_L16N_T2U_N7_QBC_AD3N_66) G19(IO_T1U_N12_67) H23(IO_L14P_T2L_N2_GC_66) H24(IO_L14N_T2L_N3_GC_66) J23(IO_L12P_T1U_N10_GC_66) J24(IO_L12N_T1U_N11_GC_66) L23(IO_L7N_T1L_N1_QBC_AD13N_66) M19(IO_L4P_T0U_N6_DBC_AD7P_66) N24(IO_L15P_T2L_N4_AD11P_A02_D18_65) N26(IO_T2U_N12_CSI_ADV_B_65) P24(IO_L15N_T2L_N5_AD11N_A03_D19_65) R22(IO_L19P_T3L_N0_DBC_AD9P_D10_65) R23(IO_L19N_T3L_N1_DBC_AD9N_D11_65) T19(IO_T3U_N12_PERSTN0_65) T24(IO_L13P_T2L_N0_GC_QBC_A06_D22_65) U24(IO_L13N_T2L_N1_GC_QBC_A07_D23_65) V19(IO_L1N_T0L_N1_DBC_RS1_65) Y23(IO_L7N_T1L_N1_QBC_AD13N_A19_65)

### Notes on the sheet
- BANK_VCC 1.2V
- BANK_VCC 1.8V
- 双向1.8V LVDS
- 输入1.2V LVDS
- (in symbol XCKU5P-FFVB676, part D) BANK 64
- (in symbol XCKU5P-FFVB676, part E) BANK 65
- (in symbol XCKU5P-FFVB676, part F) BANK 66
- (in symbol XCKU5P-FFVB676, part G) BANK 67

### Library data of the parts
R44-R51 = RES2
U2 = XCKU5P-FFVB676

## Sheet FPGA SYSTERM.SchDoc
size A3
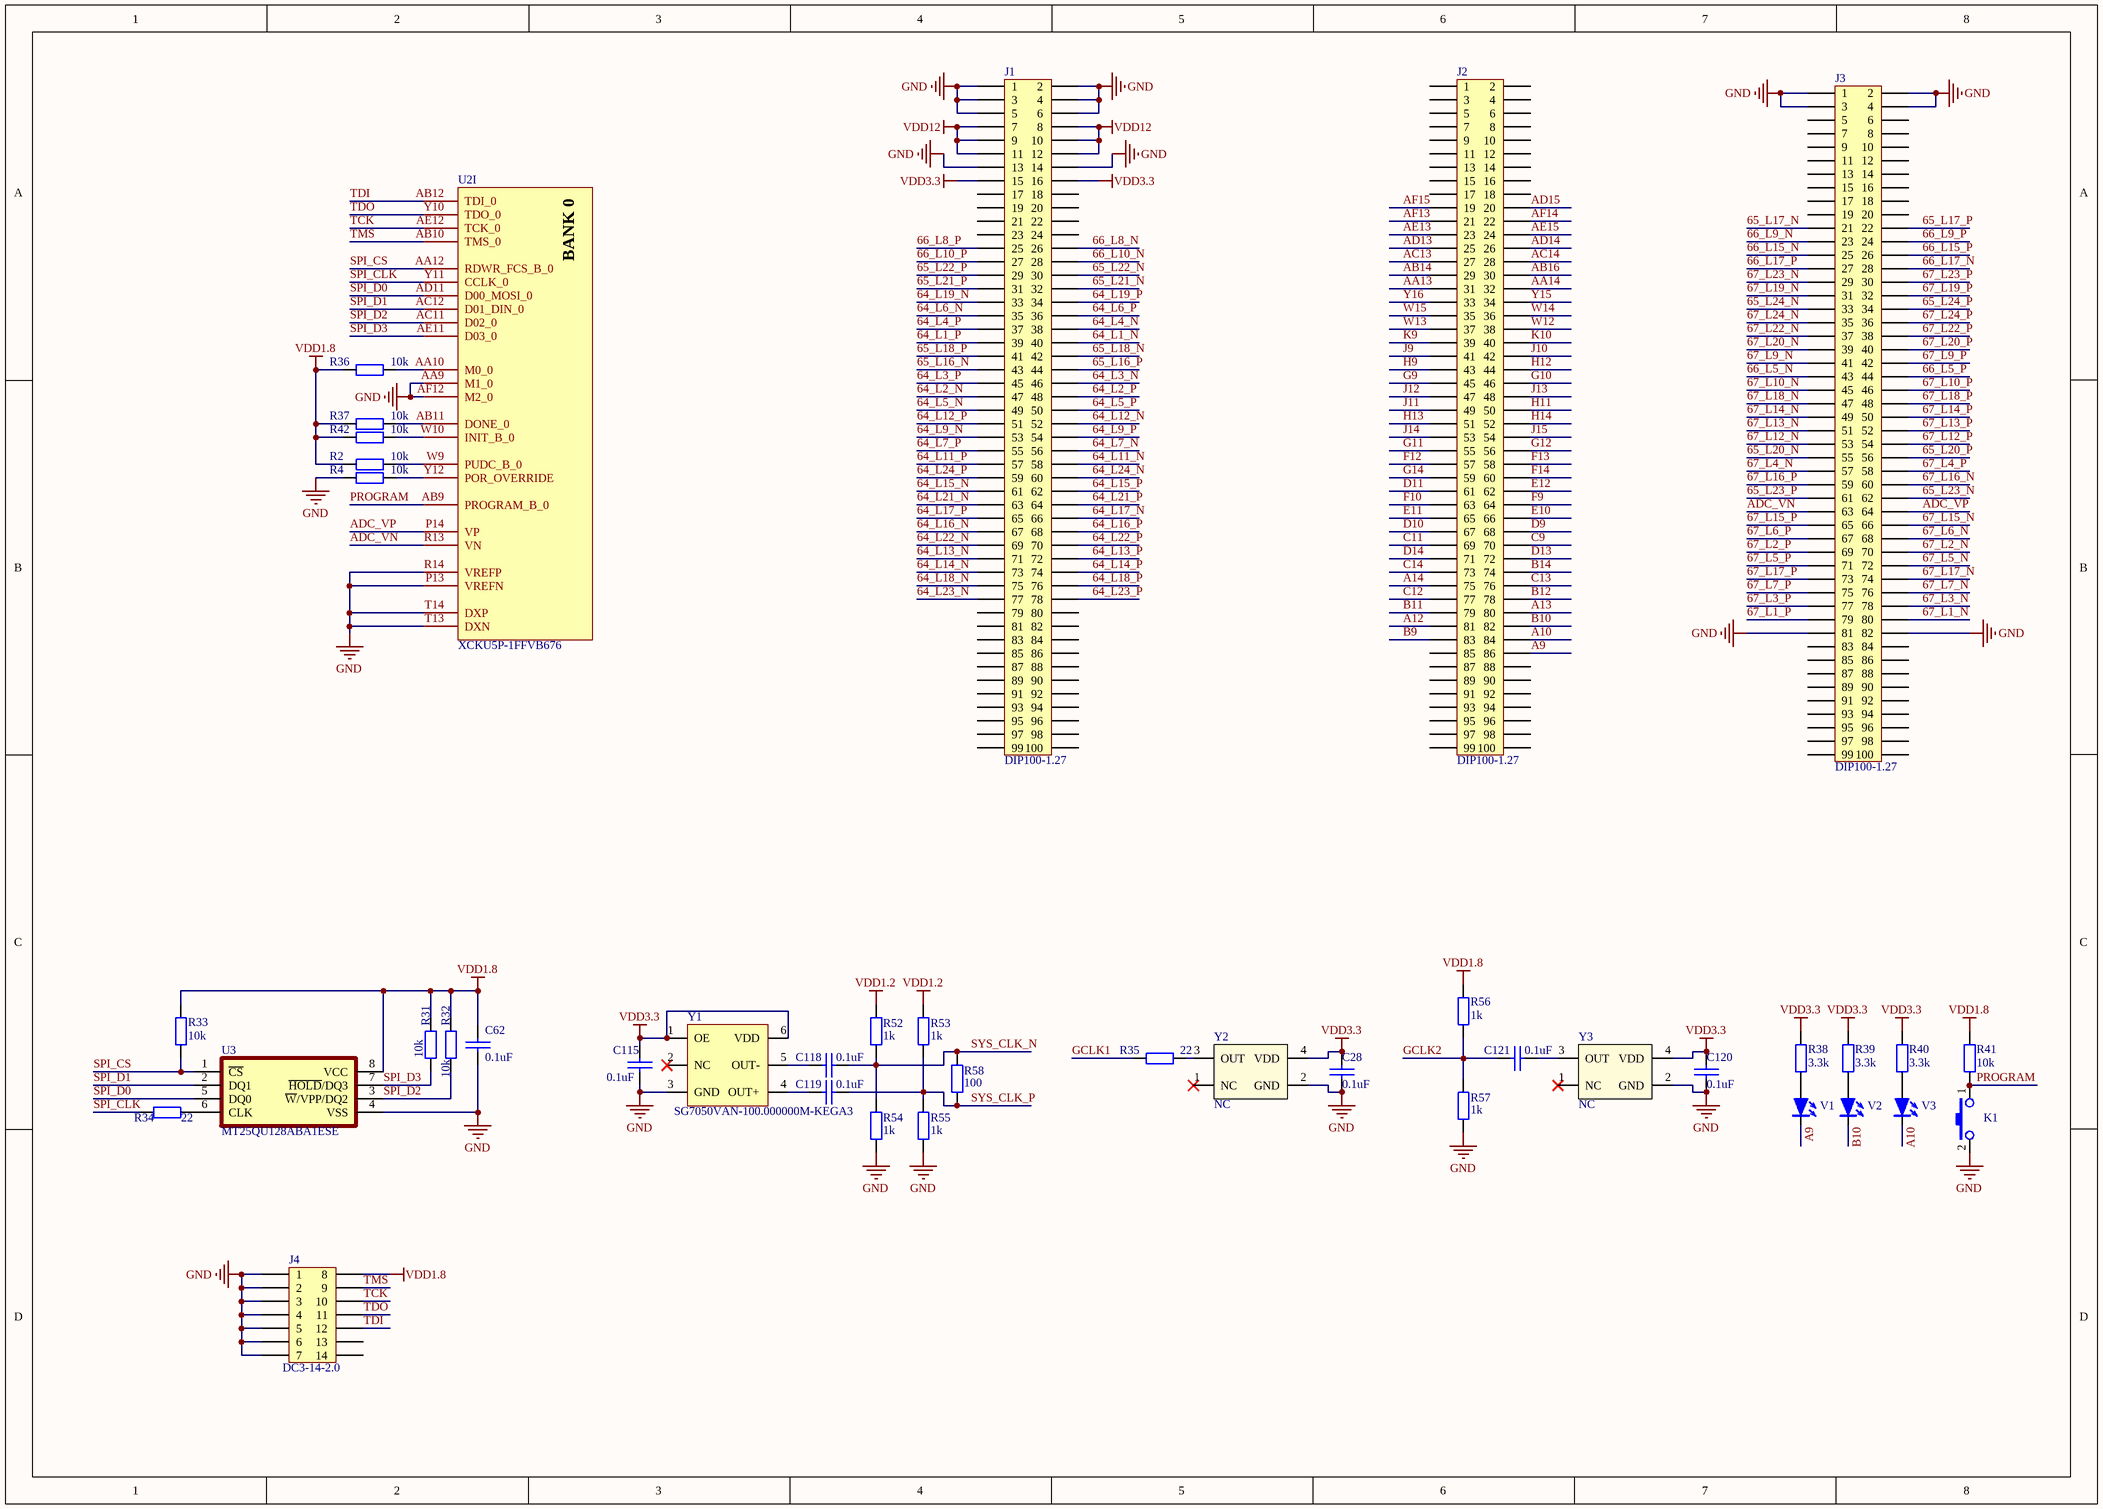
[diagram p4: FPGA SYSTERM.SchDoc]

### Parts
C28  0.1uF  [0402_C_M]
C62  0.1uF  [0402_C_M]
C115  0.1uF  [0402_C_M]
C118  0.1uF  [0402_C_M]
C119  0.1uF  [0402_C_M]
C120  0.1uF  [0402_C_M]
C121  0.1uF  [0402_C_M]
J1  DIP100-1.27  [CON100_1.27]
J2  DIP100-1.27  [CON100_1.27]
J3  DIP100-1.27  [CON100_1.27]
J4  DC3-14-2.0  [DC3-14-2.0]
K1  KEY  [KEY2]  (value not drawn)
R2  10k  [0402_R_M]
R4  10k  [0402_R_M]
R31  10k  [0402_R_M]
R32  10k  [0402_R_M]
R33  10k  [0402_R_M]
R34  22  [0402_R_M]
R35  22  [0402_R_M]
R36  10k  [0402_R_M]
R37  10k  [0402_R_M]
R38  3.3k  [0402_R_M]
R39  3.3k  [0402_R_M]
R40  3.3k  [0402_R_M]
R41  10k  [0402_R_M]
R42  10k  [0402_R_M]
R52  1k  [0402_R_M]
R53  1k  [0402_R_M]
R54  1k  [0402_R_M]
R55  1k  [0402_R_M]
R56  1k  [0402_R_M]
R57  1k  [0402_R_M]
R58  100  [0402_R_M]
U2  XCKU5P-1FFVB676  (part I of 11)
U3  MT25QU128ABA1ESE  [SOP8W]
V1  LED  [0805D]  (value not drawn)
V2  LED  [0805D]  (value not drawn)
V3  LED  [0805D]  (value not drawn)
Y1  SG7050VAN-100.000000M-KEGA3  [OSC 7050-6P]
Y2  NC  [OSC 7050-4P]
Y3  NC  [OSC 7050-4P]

### Nets
GND: C28.2 C62.2 C115.2 C120.2 J1.1 J1.2 J1.3 J1.4 J1.5 J1.6 J1.13 J1.14 J3.1 J3.2 J3.3 J3.4 J3.81 J3.82 J4.1 J4.2 J4.3 J4.4 J4.5 J4.6 J4.7 K1.2 R4.2 R54.2 R55.2 R57.2 U2.AA9(M1_0) U2.AF12(M2_0) U2.P13(VREFN) U2.R14(VREFP) U2.T13(DXN) U2.T14(DXP) U3.4(VSS) Y1.3(GND) Y2.2(GND) Y3.2(GND)
VDD1.2: R52.1 R53.1
VDD1.8: C62.1 J4.8 R2.2 R31.2 R32.2 R33.1 R36.2 R37.2 R41.2 R42.2 R56.1 U3.8(VCC)
VDD3.3: C28.1 C115.1 C120.1 J1.15 J1.16 R38.2 R39.2 R40.2 Y1.1(OE) Y1.6(VDD) Y2.4(VDD) Y3.4(VDD)
VDD12: J1.7 J1.8 J1.9 J1.10 J1.11 J1.12
64_L1_N: J1.40
64_L1_P: J1.39
64_L2_N: J1.47
64_L2_P: J1.48
64_L3_N: J1.46
64_L3_P: J1.45
64_L4_N: J1.38
64_L4_P: J1.37
64_L5_N: J1.49
64_L5_P: J1.50
64_L6_N: J1.35
64_L6_P: J1.36
64_L7_N: J1.56
64_L7_P: J1.55
64_L9_N: J1.53
64_L9_P: J1.54
64_L11_N: J1.58
64_L11_P: J1.57
64_L12_N: J1.52
64_L12_P: J1.51
64_L13_N: J1.71
64_L13_P: J1.72
64_L14_N: J1.73
64_L14_P: J1.74
64_L15_N: J1.61
64_L15_P: J1.62
64_L16_N: J1.67
64_L16_P: J1.68
64_L17_N: J1.66
64_L17_P: J1.65
64_L18_N: J1.75
64_L18_P: J1.76
64_L19_N: J1.33
64_L19_P: J1.34
64_L21_N: J1.63
64_L21_P: J1.64
64_L22_N: J1.69
64_L22_P: J1.70
64_L23_N: J1.77
64_L23_P: J1.78
64_L24_N: J1.60
64_L24_P: J1.59
65_L16_N: J1.43
65_L16_P: J1.44
65_L17_N: J3.21
65_L17_P: J3.22
65_L18_N: J1.42
65_L18_P: J1.41
65_L20_N: J3.55
65_L20_P: J3.56
65_L21_N: J1.32
65_L21_P: J1.31
65_L22_N: J1.30
65_L22_P: J1.29
65_L23_N: J3.62
65_L23_P: J3.61
65_L24_N: J3.33
65_L24_P: J3.34
66_L5_N: J3.43
66_L5_P: J3.44
66_L8_N: J1.26
66_L8_P: J1.25
66_L9_N: J3.23
66_L9_P: J3.24
66_L10_N: J1.28
66_L10_P: J1.27
66_L15_N: J3.25
66_L15_P: J3.26
66_L17_N: J3.28
66_L17_P: J3.27
67_L1_N: J3.80
67_L1_P: J3.79
67_L2_N: J3.70
67_L2_P: J3.69
67_L3_N: J3.78
67_L3_P: J3.77
67_L4_N: J3.57
67_L4_P: J3.58
67_L5_N: J3.72
67_L5_P: J3.71
67_L6_N: J3.68
67_L6_P: J3.67
67_L7_N: J3.76
67_L7_P: J3.75
67_L9_N: J3.41
67_L9_P: J3.42
67_L10_N: J3.45
67_L10_P: J3.46
67_L12_N: J3.53
67_L12_P: J3.54
67_L13_N: J3.51
67_L13_P: J3.52
67_L14_N: J3.49
67_L14_P: J3.50
67_L15_N: J3.66
67_L15_P: J3.65
67_L16_N: J3.60
67_L16_P: J3.59
67_L17_N: J3.74
67_L17_P: J3.73
67_L18_N: J3.47
67_L18_P: J3.48
67_L19_N: J3.31
67_L19_P: J3.32
67_L20_N: J3.39
67_L20_P: J3.40
67_L22_N: J3.37
67_L22_P: J3.38
67_L23_N: J3.29
67_L23_P: J3.30
67_L24_N: J3.35
67_L24_P: J3.36
A9: J2.86 V1.2
A10: J2.84 V3.2
A12: J2.81
A13: J2.80
A14: J2.75
AA13: J2.31
AA14: J2.32
AB14: J2.29
AB16: J2.30
AC13: J2.27
AC14: J2.28
AD13: J2.25
AD14: J2.26
AD15: J2.20
ADC_VN: J3.63 U2.R13(VN)
ADC_VP: J3.64 U2.P14(VP)
AE13: J2.23
AE15: J2.24
AF13: J2.21
AF14: J2.22
AF15: J2.19
B9: J2.83
B10: J2.82 V2.2
B11: J2.79
B12: J2.78
B14: J2.74
C9: J2.70
C11: J2.69
C12: J2.77
C13: J2.76
C14: J2.73
D9: J2.68
D10: J2.67
D11: J2.61
D13: J2.72
D14: J2.71
E10: J2.66
E11: J2.65
E12: J2.62
F9: J2.64
F10: J2.63
F12: J2.57
F13: J2.58
F14: J2.60
G9: J2.45
G10: J2.46
G11: J2.55
G12: J2.56
G14: J2.59
GCLK1: R35.2
GCLK2: C121.1 R56.2 R57.1
H9: J2.43
H11: J2.50
H12: J2.44
H13: J2.51
H14: J2.52
J9: J2.41
J10: J2.42
J11: J2.49
J12: J2.47
J13: J2.48
J14: J2.53
J15: J2.54
K9: J2.39
K10: J2.40
PROGRAM: K1.1 R41.1 U2.AB9(PROGRAM_B_0)
SPI_CLK: R34.2 U2.Y11(CCLK_0)
SPI_CS: R33.2 U2.AA12(RDWR_FCS_B_0) U3.1(~{CS})
SPI_D0: U2.AD11(D00_MOSI_0) U3.5(DQ0)
SPI_D1: U2.AC12(D01_DIN_0) U3.2(DQ1)
SPI_D2: R32.1 U2.AC11(D02_0) U3.3(~{W}/VPP/DQ2)
SPI_D3: R31.1 U2.AE11(D03_0) U3.7(~{HOLD}/DQ3)
SYS_CLK_N: C118.2 R52.2 R54.1 R58.1
SYS_CLK_P: C119.2 R53.2 R55.1 R58.2
TCK: J4.10 U2.AE12(TCK_0)
TDI: J4.12 U2.AB12(TDI_0)
TDO: J4.11 U2.Y10(TDO_0)
TMS: J4.9 U2.AB10(TMS_0)
W12: J2.38
W13: J2.37
W14: J2.36
W15: J2.35
Y15: J2.34
Y16: J2.33
NetC118_1: C118.1 Y1.5(OUT-)
NetC119_1: C119.1 Y1.4(OUT+)
NetC121_2: C121.2 Y3.3(OUT)
NetR2_1: R2.1 U2.W9(PUDC_B_0)
NetR4_1: R4.1 U2.Y12(POR_OVERRIDE)
NetR34_1: R34.1 U3.6(CLK)
NetR35_1: R35.1 Y2.3(OUT)
NetR36_1: R36.1 U2.AA10(M0_0)
NetR37_1: R37.1 U2.AB11(DONE_0)
NetR38_1: R38.1 V1.1
NetR39_1: R39.1 V2.1
NetR40_1: R40.1 V3.1
NetR42_1: R42.1 U2.W10(INIT_B_0)

Not connected (* = marked no-connect by the designer): J1 17 18 19 20 21 22 23 24 79 80 81 82 83 84 85 86 87 88 89 90 91 92 93 94 95 96 97 98 99 100; J2 1 2 3 4 5 6 7 8 9 10 11 12 13 14 15 16 17 18 85 87 88 89 90 91 92 93 94 95 96 97 98 99 100; J3 5 6 7 8 9 10 11 12 13 14 15 16 17 18 19 20 83 84 85 86 87 88 89 90 91 92 93 94 95 96 97 98 99 100; J4 13 14; Y1 2(NC)*; Y2 1(NC)*; Y3 1(NC)*

### Notes on the sheet
- (in symbol XCKU5P-FFVB676, part I) BANK 0

### Library data of the parts
C28 C62 C115 C118-C121 = CAP
J1-J3 = CON100
J4 = CON14
K1 = KEY1
R2 R4 R31-R42 R52-R58 = RES2
U2 = XCKU5P-FFVB676
U3 = N25Q128A11EF840E
V1-V3 = LED2
Y1 = OB7050100MLDB6SI-00
Y2 Y3 = XTAL

## Sheet DDR4.SchDoc
size A4
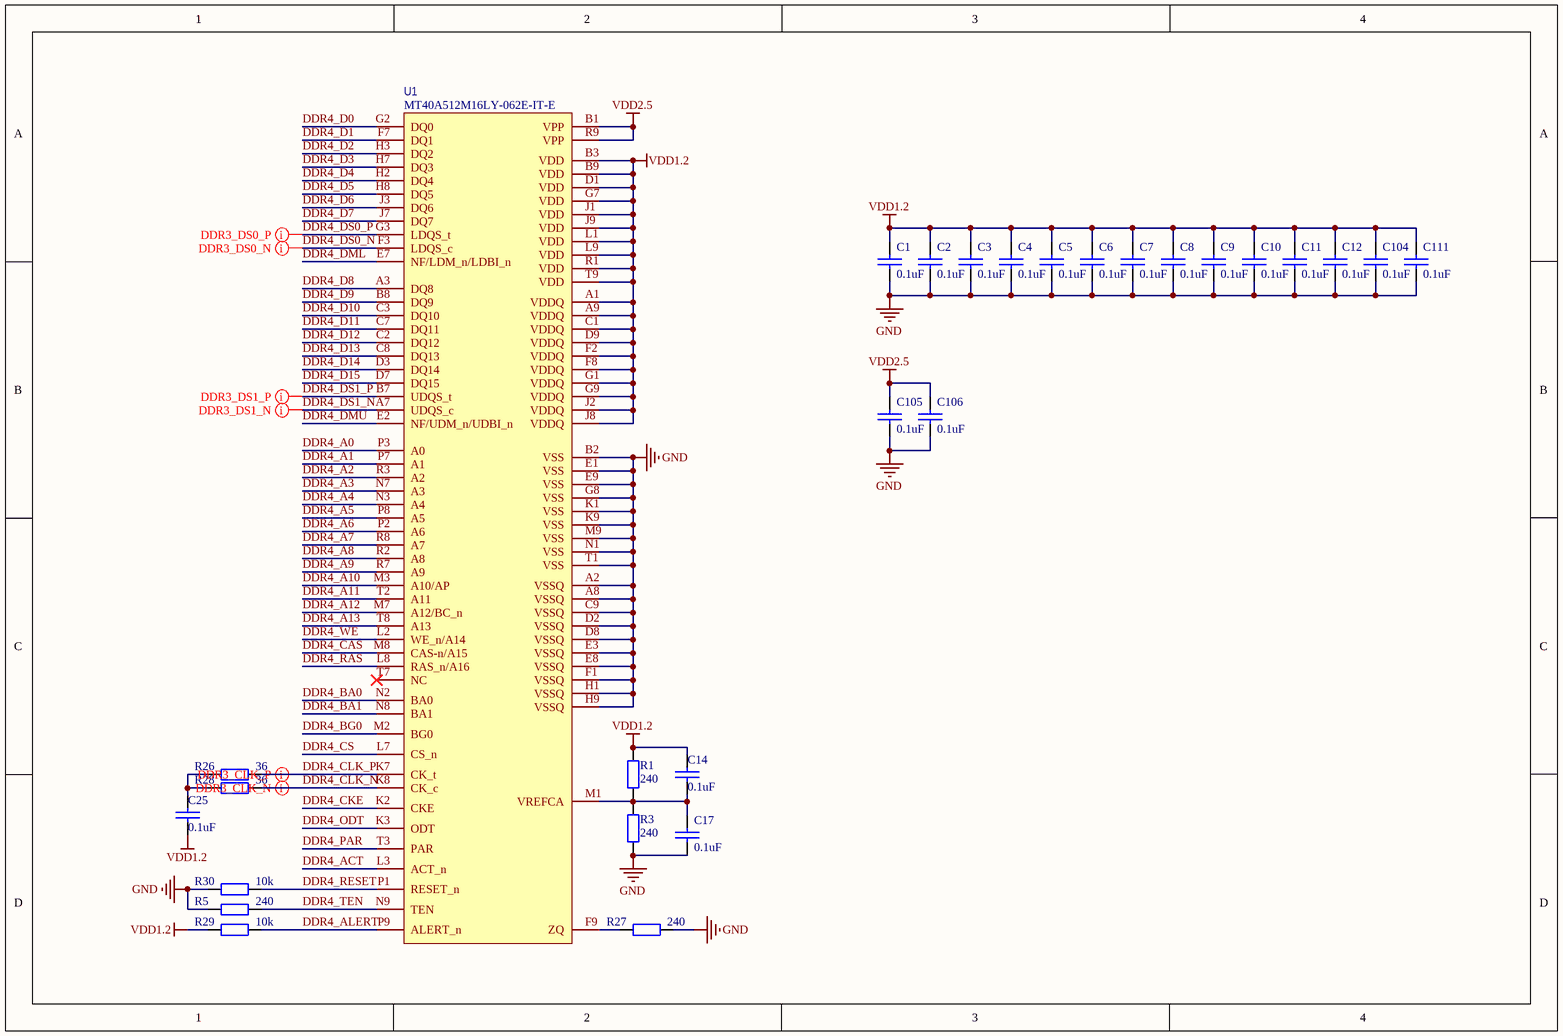
[diagram p5: DDR4.SchDoc]

### Parts
C1  0.1uF  [0402_c_m]
C2  0.1uF  [0402_c_m]
C3  0.1uF  [0402_c_m]
C4  0.1uF  [0402_c_m]
C5  0.1uF  [0402_c_m]
C6  0.1uF  [0402_c_m]
C7  0.1uF  [0402_c_m]
C8  0.1uF  [0402_c_m]
C9  0.1uF  [0402_c_m]
C10  0.1uF  [0402_c_m]
C11  0.1uF  [0402_c_m]
C12  0.1uF  [0402_c_m]
C14  0.1uF  [0402_c_m]
C17  0.1uF  [0402_c_m]
C25  0.1uF  [0402_c_m]
C104  0.1uF  [0402_c_m]
C105  0.1uF  [0402_c_m]
C106  0.1uF  [0402_c_m]
C111  0.1uF  [0402_c_m]
R1  240  [0402_r_m]
R3  240  [0402_r_m]
R5  240  [0402_R_M]
R26  36  [0402_r_m]
R27  240  [0402_R_M]
R28  36  [0402_r_m]
R29  10k  [0402_r_m]
R30  10k  [0402_r_m]
U1  MT40A512M16LY-062E-IT-E  [MT40A512M16LY-062E-IT-E]

### Nets
GND: C1.2 C2.2 C3.2 C4.2 C5.2 C6.2 C7.2 C8.2 C9.2 C10.2 C11.2 C12.2 C17.2 C104.2 C105.2 C106.2 C111.2 R3.1 R5.2 R27.1 R30.2 U1.A2(VSSQ) U1.A8(VSSQ) U1.B2(VSS) U1.C9(VSSQ) U1.D2(VSSQ) U1.D8(VSSQ) U1.E1(VSS) U1.E3(VSSQ) U1.E8(VSSQ) U1.E9(VSS) U1.F1(VSSQ) U1.G8(VSS) U1.H1(VSSQ) U1.H9(VSSQ) U1.K1(VSS) U1.K9(VSS) U1.M9(VSS) U1.N1(VSS) U1.T1(VSS)
VDD1.2: C1.1 C2.1 C3.1 C4.1 C5.1 C6.1 C7.1 C8.1 C9.1 C10.1 C11.1 C12.1 C14.1 C25.1 C104.1 C111.1 R1.2 R29.2 U1.A1(VDDQ) U1.A9(VDDQ) U1.B3(VDD) U1.B9(VDD) U1.C1(VDDQ) U1.D1(VDD) U1.D9(VDDQ) U1.F2(VDDQ) U1.F8(VDDQ) U1.G1(VDDQ) U1.G7(VDD) U1.G9(VDDQ) U1.J1(VDD) U1.J2(VDDQ) U1.J8(VDDQ) U1.J9(VDD) U1.L1(VDD) U1.L9(VDD) U1.R1(VDD) U1.T9(VDD)
VDD2.5: C105.1 C106.1 U1.B1(VPP) U1.R9(VPP)
DDR4_A0: U1.P3(A0)
DDR4_A1: U1.P7(A1)
DDR4_A2: U1.R3(A2)
DDR4_A3: U1.N7(A3)
DDR4_A4: U1.N3(A4)
DDR4_A5: U1.P8(A5)
DDR4_A6: U1.P2(A6)
DDR4_A7: U1.R8(A7)
DDR4_A8: U1.R2(A8)
DDR4_A9: U1.R7(A9)
DDR4_A10: U1.M3(A10/AP)
DDR4_A11: U1.T2(A11)
DDR4_A12: U1.M7(A12/BC_n)
DDR4_A13: U1.T8(A13)
DDR4_ACT: U1.L3(ACT_n)
DDR4_ALERT: R29.1 U1.P9(ALERT_n)
DDR4_BA0: U1.N2(BA0)
DDR4_BA1: U1.N8(BA1)
DDR4_BG0: U1.M2(BG0)
DDR4_CAS: U1.M8(CAS-n/A15)
DDR4_CKE: U1.K2(CKE)
DDR4_CLK_N: R28.2 U1.K8(CK_c)
DDR4_CLK_P: R26.2 U1.K7(CK_t)
DDR4_CS: U1.L7(CS_n)
DDR4_D0: U1.G2(DQ0)
DDR4_D1: U1.F7(DQ1)
DDR4_D2: U1.H3(DQ2)
DDR4_D3: U1.H7(DQ3)
DDR4_D4: U1.H2(DQ4)
DDR4_D5: U1.H8(DQ5)
DDR4_D6: U1.J3(DQ6)
DDR4_D7: U1.J7(DQ7)
DDR4_D8: U1.A3(DQ8)
DDR4_D9: U1.B8(DQ9)
DDR4_D10: U1.C3(DQ10)
DDR4_D11: U1.C7(DQ11)
DDR4_D12: U1.C2(DQ12)
DDR4_D13: U1.C8(DQ13)
DDR4_D14: U1.D3(DQ14)
DDR4_D15: U1.D7(DQ15)
DDR4_DML: U1.E7(NF/LDM_n/LDBI_n)
DDR4_DMU: U1.E2(NF/UDM_n/UDBI_n)
DDR4_DS0_N: U1.F3(LDQS_c)
DDR4_DS0_P: U1.G3(LDQS_t)
DDR4_DS1_N: U1.A7(UDQS_c)
DDR4_DS1_P: U1.B7(UDQS_t)
DDR4_ODT: U1.K3(ODT)
DDR4_PAR: U1.T3(PAR)
DDR4_RAS: U1.L8(RAS_n/A16)
DDR4_RESET: R30.1 U1.P1(RESET_n)
DDR4_TEN: R5.1 U1.N9(TEN)
DDR4_WE: U1.L2(WE_n/A14)
NetC14_2: C14.2 C17.1 R1.1 R3.2 U1.M1(VREFCA)
NetC25_2: C25.2 R26.1 R28.1
NetR27_2: R27.2 U1.F9(ZQ)

Not connected (* = marked no-connect by the designer): U1 T7(NC)*

### Layout directives
differential pair: DDR4_CLK_N, DDR4_CLK_P, DDR4_DS0_N, DDR4_DS0_P, DDR4_DS1_N, DDR4_DS1_P

### Library data of the parts
C1-C12 C14 C17 C25 C104-C106 C111 = CAP
R1 R3 R5 R26-R30 = RES2
U1 = MT40A512M16LY-062E IT:E

## Nets that join several sheets
GND: POWER (41 pins), FPGA POWER (321 pins), FPGA HP BANK (8 pins), FPGA SYSTERM (40 pins), DDR4 (40 pins)
VDD0.85: POWER (7 pins), FPGA POWER (84 pins)
VDD1.2: POWER (C100.1 L4.2 R16.2), FPGA POWER (12 pins), FPGA SYSTERM (R52.1 R53.1), DDR4 (38 pins)
VDD1.8: POWER (C99.1 L3.2 R13.2), FPGA POWER (25 pins), FPGA SYSTERM (12 pins)
VDD2.5: POWER (C103.1 L2.2 R7.2), DDR4 (C105.1 C106.1 U1.B1 U1.R9)
VDD3.3: POWER (C86.1 L1.2 R10.2 R43.2), FPGA POWER (12 pins), FPGA SYSTERM (12 pins)
VDD12: POWER (20 pins), FPGA SYSTERM (6 pins)
64_L1_N: FPGA HP BANK (U2.AE26), FPGA SYSTERM (J1.40)
64_L1_P: FPGA HP BANK (U2.AE25), FPGA SYSTERM (J1.39)
64_L2_N: FPGA HP BANK (U2.AB26), FPGA SYSTERM (J1.47)
64_L2_P: FPGA HP BANK (U2.AB25), FPGA SYSTERM (J1.48)
64_L3_N: FPGA HP BANK (U2.AF25), FPGA SYSTERM (J1.46)
64_L3_P: FPGA HP BANK (U2.AF24), FPGA SYSTERM (J1.45)
64_L4_N: FPGA HP BANK (U2.AD26), FPGA SYSTERM (J1.38)
64_L4_P: FPGA HP BANK (U2.AC26), FPGA SYSTERM (J1.37)
64_L5_N: FPGA HP BANK (U2.AD25), FPGA SYSTERM (J1.49)
64_L5_P: FPGA HP BANK (U2.AD24), FPGA SYSTERM (J1.50)
64_L6_N: FPGA HP BANK (U2.AC24), FPGA SYSTERM (J1.35)
64_L6_P: FPGA HP BANK (U2.AB24), FPGA SYSTERM (J1.36)
64_L7_N: FPGA HP BANK (U2.AF22), FPGA SYSTERM (J1.56)
64_L7_P: FPGA HP BANK (U2.AE22), FPGA SYSTERM (J1.55)
64_L9_N: FPGA HP BANK (U2.AC23), FPGA SYSTERM (J1.53)
64_L9_P: FPGA HP BANK (U2.AC22), FPGA SYSTERM (J1.54)
64_L11_N: FPGA HP BANK (U2.AE21), FPGA SYSTERM (J1.58)
64_L11_P: FPGA HP BANK (U2.AD21), FPGA SYSTERM (J1.57)
64_L12_N: FPGA HP BANK (U2.AC21), FPGA SYSTERM (J1.52)
64_L12_P: FPGA HP BANK (U2.AB21), FPGA SYSTERM (J1.51)
64_L13_N: FPGA HP BANK (U2.AE20), FPGA SYSTERM (J1.71)
64_L13_P: FPGA HP BANK (U2.AD20), FPGA SYSTERM (J1.72)
64_L14_N: FPGA HP BANK (U2.AD19), FPGA SYSTERM (J1.73)
64_L14_P: FPGA HP BANK (U2.AC19), FPGA SYSTERM (J1.74)
64_L15_N: FPGA HP BANK (U2.AF19), FPGA SYSTERM (J1.61)
64_L15_P: FPGA HP BANK (U2.AF18), FPGA SYSTERM (J1.62)
64_L16_N: FPGA HP BANK (U2.AD18), FPGA SYSTERM (J1.67)
64_L16_P: FPGA HP BANK (U2.AC18), FPGA SYSTERM (J1.68)
64_L17_N: FPGA HP BANK (U2.AF17), FPGA SYSTERM (J1.66)
64_L17_P: FPGA HP BANK (U2.AE17), FPGA SYSTERM (J1.65)
64_L18_N: FPGA HP BANK (U2.AE16), FPGA SYSTERM (J1.75)
64_L18_P: FPGA HP BANK (U2.AD16), FPGA SYSTERM (J1.76)
64_L19_N: FPGA HP BANK (U2.Y21), FPGA SYSTERM (J1.33)
64_L19_P: FPGA HP BANK (U2.Y20), FPGA SYSTERM (J1.34)
64_L21_N: FPGA HP BANK (U2.AB20), FPGA SYSTERM (J1.63)
64_L21_P: FPGA HP BANK (U2.AA20), FPGA SYSTERM (J1.64)
64_L22_N: FPGA HP BANK (U2.AC17), FPGA SYSTERM (J1.69)
64_L22_P: FPGA HP BANK (U2.AB17), FPGA SYSTERM (J1.70)
64_L23_N: FPGA HP BANK (U2.AA17), FPGA SYSTERM (J1.77)
64_L23_P: FPGA HP BANK (U2.Y17), FPGA SYSTERM (J1.78)
64_L24_N: FPGA HP BANK (U2.AA18), FPGA SYSTERM (J1.60)
64_L24_P: FPGA HP BANK (U2.Y18), FPGA SYSTERM (J1.59)
65_L16_N: FPGA HP BANK (U2.V26), FPGA SYSTERM (J1.43)
65_L16_P: FPGA HP BANK (U2.U26), FPGA SYSTERM (J1.44)
65_L17_N: FPGA HP BANK (U2.P26), FPGA SYSTERM (J3.21)
65_L17_P: FPGA HP BANK (U2.P25), FPGA SYSTERM (J3.22)
65_L18_N: FPGA HP BANK (U2.R26), FPGA SYSTERM (J1.42)
65_L18_P: FPGA HP BANK (U2.R25), FPGA SYSTERM (J1.41)
65_L20_N: FPGA HP BANK (U2.P21), FPGA SYSTERM (J3.55)
65_L20_P: FPGA HP BANK (U2.P20), FPGA SYSTERM (J3.56)
65_L21_N: FPGA HP BANK (U2.R21), FPGA SYSTERM (J1.32)
65_L21_P: FPGA HP BANK (U2.R20), FPGA SYSTERM (J1.31)
65_L22_N: FPGA HP BANK (U2.P23), FPGA SYSTERM (J1.30)
65_L22_P: FPGA HP BANK (U2.N23), FPGA SYSTERM (J1.29)
65_L23_N: FPGA HP BANK (U2.P19), FPGA SYSTERM (J3.62)
65_L23_P: FPGA HP BANK (U2.N19), FPGA SYSTERM (J3.61)
65_L24_N: FPGA HP BANK (U2.N22), FPGA SYSTERM (J3.33)
65_L24_P: FPGA HP BANK (U2.N21), FPGA SYSTERM (J3.34)
66_L5_N: FPGA HP BANK (U2.J21), FPGA SYSTERM (J3.43)
66_L5_P: FPGA HP BANK (U2.K21), FPGA SYSTERM (J3.44)
66_L8_N: FPGA HP BANK (U2.M26), FPGA SYSTERM (J1.26)
66_L8_P: FPGA HP BANK (U2.M25), FPGA SYSTERM (J1.25)
66_L9_N: FPGA HP BANK (U2.K26), FPGA SYSTERM (J3.23)
66_L9_P: FPGA HP BANK (U2.K25), FPGA SYSTERM (J3.24)
66_L10_N: FPGA HP BANK (U2.L25), FPGA SYSTERM (J1.28)
66_L10_P: FPGA HP BANK (U2.L24), FPGA SYSTERM (J1.27)
66_L15_N: FPGA HP BANK (U2.J26), FPGA SYSTERM (J3.25)
66_L15_P: FPGA HP BANK (U2.J25), FPGA SYSTERM (J3.26)
66_L17_N: FPGA HP BANK (U2.G26), FPGA SYSTERM (J3.28)
66_L17_P: FPGA HP BANK (U2.H26), FPGA SYSTERM (J3.27)
67_L1_N: FPGA HP BANK (U2.F15), FPGA SYSTERM (J3.80)
67_L1_P: FPGA HP BANK (U2.G15), FPGA SYSTERM (J3.79)
67_L2_N: FPGA HP BANK (U2.G17), FPGA SYSTERM (J3.70)
67_L2_P: FPGA HP BANK (U2.H17), FPGA SYSTERM (J3.69)
67_L3_N: FPGA HP BANK (U2.D15), FPGA SYSTERM (J3.78)
67_L3_P: FPGA HP BANK (U2.E15), FPGA SYSTERM (J3.77)
67_L4_N: FPGA HP BANK (U2.E17), FPGA SYSTERM (J3.57)
67_L4_P: FPGA HP BANK (U2.E16), FPGA SYSTERM (J3.58)
67_L5_N: FPGA HP BANK (U2.G16), FPGA SYSTERM (J3.72)
67_L5_P: FPGA HP BANK (U2.H16), FPGA SYSTERM (J3.71)
67_L6_N: FPGA HP BANK (U2.C16), FPGA SYSTERM (J3.68)
67_L6_P: FPGA HP BANK (U2.D16), FPGA SYSTERM (J3.67)
67_L7_N: FPGA HP BANK (U2.H19), FPGA SYSTERM (J3.76)
67_L7_P: FPGA HP BANK (U2.H18), FPGA SYSTERM (J3.75)
67_L9_N: FPGA HP BANK (U2.G21), FPGA SYSTERM (J3.41)
67_L9_P: FPGA HP BANK (U2.G20), FPGA SYSTERM (J3.42)
67_L10_N: FPGA HP BANK (U2.E20), FPGA SYSTERM (J3.45)
67_L10_P: FPGA HP BANK (U2.F20), FPGA SYSTERM (J3.46)
67_L12_N: FPGA HP BANK (U2.D20), FPGA SYSTERM (J3.53)
67_L12_P: FPGA HP BANK (U2.D19), FPGA SYSTERM (J3.54)
67_L13_N: FPGA HP BANK (U2.C19), FPGA SYSTERM (J3.51)
67_L13_P: FPGA HP BANK (U2.C18), FPGA SYSTERM (J3.52)
67_L14_N: FPGA HP BANK (U2.B20), FPGA SYSTERM (J3.49)
67_L14_P: FPGA HP BANK (U2.B19), FPGA SYSTERM (J3.50)
67_L15_N: FPGA HP BANK (U2.B17), FPGA SYSTERM (J3.66)
67_L15_P: FPGA HP BANK (U2.C17), FPGA SYSTERM (J3.65)
67_L16_N: FPGA HP BANK (U2.A18), FPGA SYSTERM (J3.60)
67_L16_P: FPGA HP BANK (U2.A17), FPGA SYSTERM (J3.59)
67_L17_N: FPGA HP BANK (U2.A15), FPGA SYSTERM (J3.74)
67_L17_P: FPGA HP BANK (U2.B15), FPGA SYSTERM (J3.73)
67_L18_N: FPGA HP BANK (U2.A20), FPGA SYSTERM (J3.47)
67_L18_P: FPGA HP BANK (U2.A19), FPGA SYSTERM (J3.48)
67_L19_N: FPGA HP BANK (U2.A23), FPGA SYSTERM (J3.31)
67_L19_P: FPGA HP BANK (U2.A22), FPGA SYSTERM (J3.32)
67_L20_N: FPGA HP BANK (U2.D21), FPGA SYSTERM (J3.39)
67_L20_P: FPGA HP BANK (U2.E21), FPGA SYSTERM (J3.40)
67_L22_N: FPGA HP BANK (U2.B21), FPGA SYSTERM (J3.37)
67_L22_P: FPGA HP BANK (U2.C21), FPGA SYSTERM (J3.38)
67_L23_N: FPGA HP BANK (U2.A25), FPGA SYSTERM (J3.29)
67_L23_P: FPGA HP BANK (U2.A24), FPGA SYSTERM (J3.30)
67_L24_N: FPGA HP BANK (U2.B22), FPGA SYSTERM (J3.35)
67_L24_P: FPGA HP BANK (U2.C22), FPGA SYSTERM (J3.36)
A9: FPGA HD BANK (U2.A9), FPGA SYSTERM (J2.86 V1.2)
A10: FPGA HD BANK (U2.A10), FPGA SYSTERM (J2.84 V3.2)
A12: FPGA HD BANK (U2.A12), FPGA SYSTERM (J2.81)
A13: FPGA HD BANK (U2.A13), FPGA SYSTERM (J2.80)
A14: FPGA HD BANK (U2.A14), FPGA SYSTERM (J2.75)
AA13: FPGA HD BANK (U2.AA13), FPGA SYSTERM (J2.31)
AA14: FPGA HD BANK (U2.AA14), FPGA SYSTERM (J2.32)
AB14: FPGA HD BANK (U2.AB14), FPGA SYSTERM (J2.29)
AB16: FPGA HD BANK (U2.AB16), FPGA SYSTERM (J2.30)
AC13: FPGA HD BANK (U2.AC13), FPGA SYSTERM (J2.27)
AC14: FPGA HD BANK (U2.AC14), FPGA SYSTERM (J2.28)
AD13: FPGA HD BANK (U2.AD13), FPGA SYSTERM (J2.25)
AD14: FPGA HD BANK (U2.AD14), FPGA SYSTERM (J2.26)
AD15: FPGA HD BANK (U2.AD15), FPGA SYSTERM (J2.20)
AE13: FPGA HD BANK (U2.AE13), FPGA SYSTERM (J2.23)
AE15: FPGA HD BANK (U2.AE15), FPGA SYSTERM (J2.24)
AF13: FPGA HD BANK (U2.AF13), FPGA SYSTERM (J2.21)
AF14: FPGA HD BANK (U2.AF14), FPGA SYSTERM (J2.22)
AF15: FPGA HD BANK (U2.AF15), FPGA SYSTERM (J2.19)
B9: FPGA HD BANK (U2.B9), FPGA SYSTERM (J2.83)
B10: FPGA HD BANK (U2.B10), FPGA SYSTERM (J2.82 V2.2)
B11: FPGA HD BANK (U2.B11), FPGA SYSTERM (J2.79)
B12: FPGA HD BANK (U2.B12), FPGA SYSTERM (J2.78)
B14: FPGA HD BANK (U2.B14), FPGA SYSTERM (J2.74)
C9: FPGA HD BANK (U2.C9), FPGA SYSTERM (J2.70)
C11: FPGA HD BANK (U2.C11), FPGA SYSTERM (J2.69)
C12: FPGA HD BANK (U2.C12), FPGA SYSTERM (J2.77)
C13: FPGA HD BANK (U2.C13), FPGA SYSTERM (J2.76)
C14: FPGA HD BANK (U2.C14), FPGA SYSTERM (J2.73)
D9: FPGA HD BANK (U2.D9), FPGA SYSTERM (J2.68)
D10: FPGA HD BANK (U2.D10), FPGA SYSTERM (J2.67)
D11: FPGA HD BANK (U2.D11), FPGA SYSTERM (J2.61)
D13: FPGA HD BANK (U2.D13), FPGA SYSTERM (J2.72)
D14: FPGA HD BANK (U2.D14), FPGA SYSTERM (J2.71)
DDR4_A0: FPGA HP BANK (U2.F22), DDR4 (U1.P3)
DDR4_A1: FPGA HP BANK (U2.K20), DDR4 (U1.P7)
DDR4_A2: FPGA HP BANK (U2.C26), DDR4 (U1.R3)
DDR4_A3: FPGA HP BANK (U2.K18), DDR4 (U1.N7)
DDR4_A4: FPGA HP BANK (U2.K22), DDR4 (U1.N3)
DDR4_A5: FPGA HP BANK (U2.L19), DDR4 (U1.P8)
DDR4_A6: FPGA HP BANK (U2.D23), DDR4 (U1.P2)
DDR4_A7: FPGA HP BANK (U2.J20), DDR4 (U1.R8)
DDR4_A8: FPGA HP BANK (U2.C24), DDR4 (U1.R2)
DDR4_A9: FPGA HP BANK (U2.J19), DDR4 (U1.R7)
DDR4_A10: FPGA HP BANK (U2.L22), DDR4 (U1.M3)
DDR4_A11: FPGA HP BANK (U2.B26), DDR4 (U1.T2)
DDR4_A12: FPGA HP BANK (U2.M20), DDR4 (U1.M7)
DDR4_A13: FPGA HP BANK (U2.D24), DDR4 (U1.T8)
DDR4_ACT: FPGA HP BANK (U2.M21), DDR4 (U1.L3)
DDR4_ALERT: FPGA HP BANK (U2.D25), DDR4 (R29.1 U1.P9)
DDR4_BA0: FPGA HP BANK (U2.E23), DDR4 (U1.N2)
DDR4_BA1: FPGA HP BANK (U2.H22), DDR4 (U1.N8)
DDR4_BG0: FPGA HP BANK (U2.E25), DDR4 (U1.M2)
DDR4_CAS: FPGA HP BANK (U2.L18), DDR4 (U1.M8)
DDR4_CKE: FPGA HP BANK (U2.K23), DDR4 (U1.K2)
DDR4_CLK_N: FPGA HP BANK (U2.G25), DDR4 (R28.2 U1.K8)
DDR4_CLK_P: FPGA HP BANK (U2.G24), DDR4 (R26.2 U1.K7)
DDR4_CS: FPGA HP BANK (U2.G22), DDR4 (U1.L7)
DDR4_D0: FPGA HP BANK (U2.U22), DDR4 (U1.G2)
DDR4_D1: FPGA HP BANK (U2.W20), DDR4 (U1.F7)
DDR4_D2: FPGA HP BANK (U2.U20), DDR4 (U1.H3)
DDR4_D3: FPGA HP BANK (U2.W19), DDR4 (U1.H7)
DDR4_D4: FPGA HP BANK (U2.U21), DDR4 (U1.H2)
DDR4_D5: FPGA HP BANK (U2.T22), DDR4 (U1.H8)
DDR4_D6: FPGA HP BANK (U2.T23), DDR4 (U1.J3)
DDR4_D7: FPGA HP BANK (U2.T20), DDR4 (U1.J7)
DDR4_D8: FPGA HP BANK (U2.AA24), DDR4 (U1.A3)
DDR4_D9: FPGA HP BANK (U2.Y25), DDR4 (U1.B8)
DDR4_D10: FPGA HP BANK (U2.V24), DDR4 (U1.C3)
DDR4_D11: FPGA HP BANK (U2.Y26), DDR4 (U1.C7)
DDR4_D12: FPGA HP BANK (U2.AA25), DDR4 (U1.C2)
DDR4_D13: FPGA HP BANK (U2.W24), DDR4 (U1.C8)
DDR4_D14: FPGA HP BANK (U2.W23), DDR4 (U1.D3)
DDR4_D15: FPGA HP BANK (U2.V23), DDR4 (U1.D7)
DDR4_DML: FPGA HP BANK (U2.U19), DDR4 (U1.E7)
DDR4_DMU: FPGA HP BANK (U2.Y22), DDR4 (U1.E2)
DDR4_DS0_N: FPGA HP BANK (U2.V22), DDR4 (U1.F3)
DDR4_DS0_P: FPGA HP BANK (U2.V21), DDR4 (U1.G3)
DDR4_DS1_N: FPGA HP BANK (U2.W26), DDR4 (U1.A7)
DDR4_DS1_P: FPGA HP BANK (U2.W25), DDR4 (U1.B7)
DDR4_ODT: FPGA HP BANK (U2.M24), DDR4 (U1.K3)
DDR4_PAR: FPGA HP BANK (U2.B25), DDR4 (U1.T3)
DDR4_RAS: FPGA HP BANK (U2.L20), DDR4 (U1.L8)
DDR4_RESET: FPGA HP BANK (U2.D26), DDR4 (R30.1 U1.P1)
DDR4_TEN: FPGA HP BANK (U2.H21), DDR4 (R5.1 U1.N9)
DDR4_WE: FPGA HP BANK (U2.F23), DDR4 (U1.L2)
E10: FPGA HD BANK (U2.E10), FPGA SYSTERM (J2.66)
E11: FPGA HD BANK (U2.E11), FPGA SYSTERM (J2.65)
E12: FPGA HD BANK (U2.E12), FPGA SYSTERM (J2.62)
F9: FPGA HD BANK (U2.F9), FPGA SYSTERM (J2.64)
F10: FPGA HD BANK (U2.F10), FPGA SYSTERM (J2.63)
F12: FPGA HD BANK (U2.F12), FPGA SYSTERM (J2.57)
F13: FPGA HD BANK (U2.F13), FPGA SYSTERM (J2.58)
F14: FPGA HD BANK (U2.F14), FPGA SYSTERM (J2.60)
G9: FPGA HD BANK (U2.G9), FPGA SYSTERM (J2.45)
G10: FPGA HD BANK (U2.G10), FPGA SYSTERM (J2.46)
G11: FPGA HD BANK (U2.G11), FPGA SYSTERM (J2.55)
G12: FPGA HD BANK (U2.G12), FPGA SYSTERM (J2.56)
G14: FPGA HD BANK (U2.G14), FPGA SYSTERM (J2.59)
GCLK1: FPGA HD BANK (U2.AB15), FPGA SYSTERM (R35.2)
GCLK2: FPGA HP BANK (U2.E18), FPGA SYSTERM (C121.1 R56.2 R57.1)
H9: FPGA HD BANK (U2.H9), FPGA SYSTERM (J2.43)
H11: FPGA HD BANK (U2.H11), FPGA SYSTERM (J2.50)
H12: FPGA HD BANK (U2.H12), FPGA SYSTERM (J2.44)
H13: FPGA HD BANK (U2.H13), FPGA SYSTERM (J2.51)
H14: FPGA HD BANK (U2.H14), FPGA SYSTERM (J2.52)
J9: FPGA HD BANK (U2.J9), FPGA SYSTERM (J2.41)
J10: FPGA HD BANK (U2.J10), FPGA SYSTERM (J2.42)
J11: FPGA HD BANK (U2.J11), FPGA SYSTERM (J2.49)
J12: FPGA HD BANK (U2.J12), FPGA SYSTERM (J2.47)
J13: FPGA HD BANK (U2.J13), FPGA SYSTERM (J2.48)
J14: FPGA HD BANK (U2.J14), FPGA SYSTERM (J2.53)
J15: FPGA HD BANK (U2.J15), FPGA SYSTERM (J2.54)
K9: FPGA HD BANK (U2.K9), FPGA SYSTERM (J2.39)
K10: FPGA HD BANK (U2.K10), FPGA SYSTERM (J2.40)
SYS_CLK_N: FPGA HP BANK (U2.U25), FPGA SYSTERM (C118.2 R52.2 R54.1 R58.1)
SYS_CLK_P: FPGA HP BANK (U2.T25), FPGA SYSTERM (C119.2 R53.2 R55.1 R58.2)
W12: FPGA HD BANK (U2.W12), FPGA SYSTERM (J2.38)
W13: FPGA HD BANK (U2.W13), FPGA SYSTERM (J2.37)
W14: FPGA HD BANK (U2.W14), FPGA SYSTERM (J2.36)
W15: FPGA HD BANK (U2.W15), FPGA SYSTERM (J2.35)
Y15: FPGA HD BANK (U2.Y15), FPGA SYSTERM (J2.34)
Y16: FPGA HD BANK (U2.Y16), FPGA SYSTERM (J2.33)